# EAGLE design FilterSchematic_REV2 (EAGLE 8.2.2)
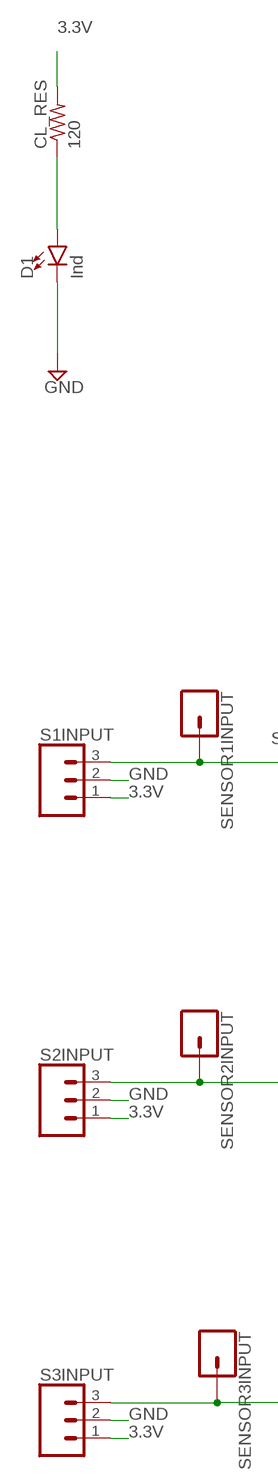
[diagram p0: schematic, sheet 1, part 1 of 2]
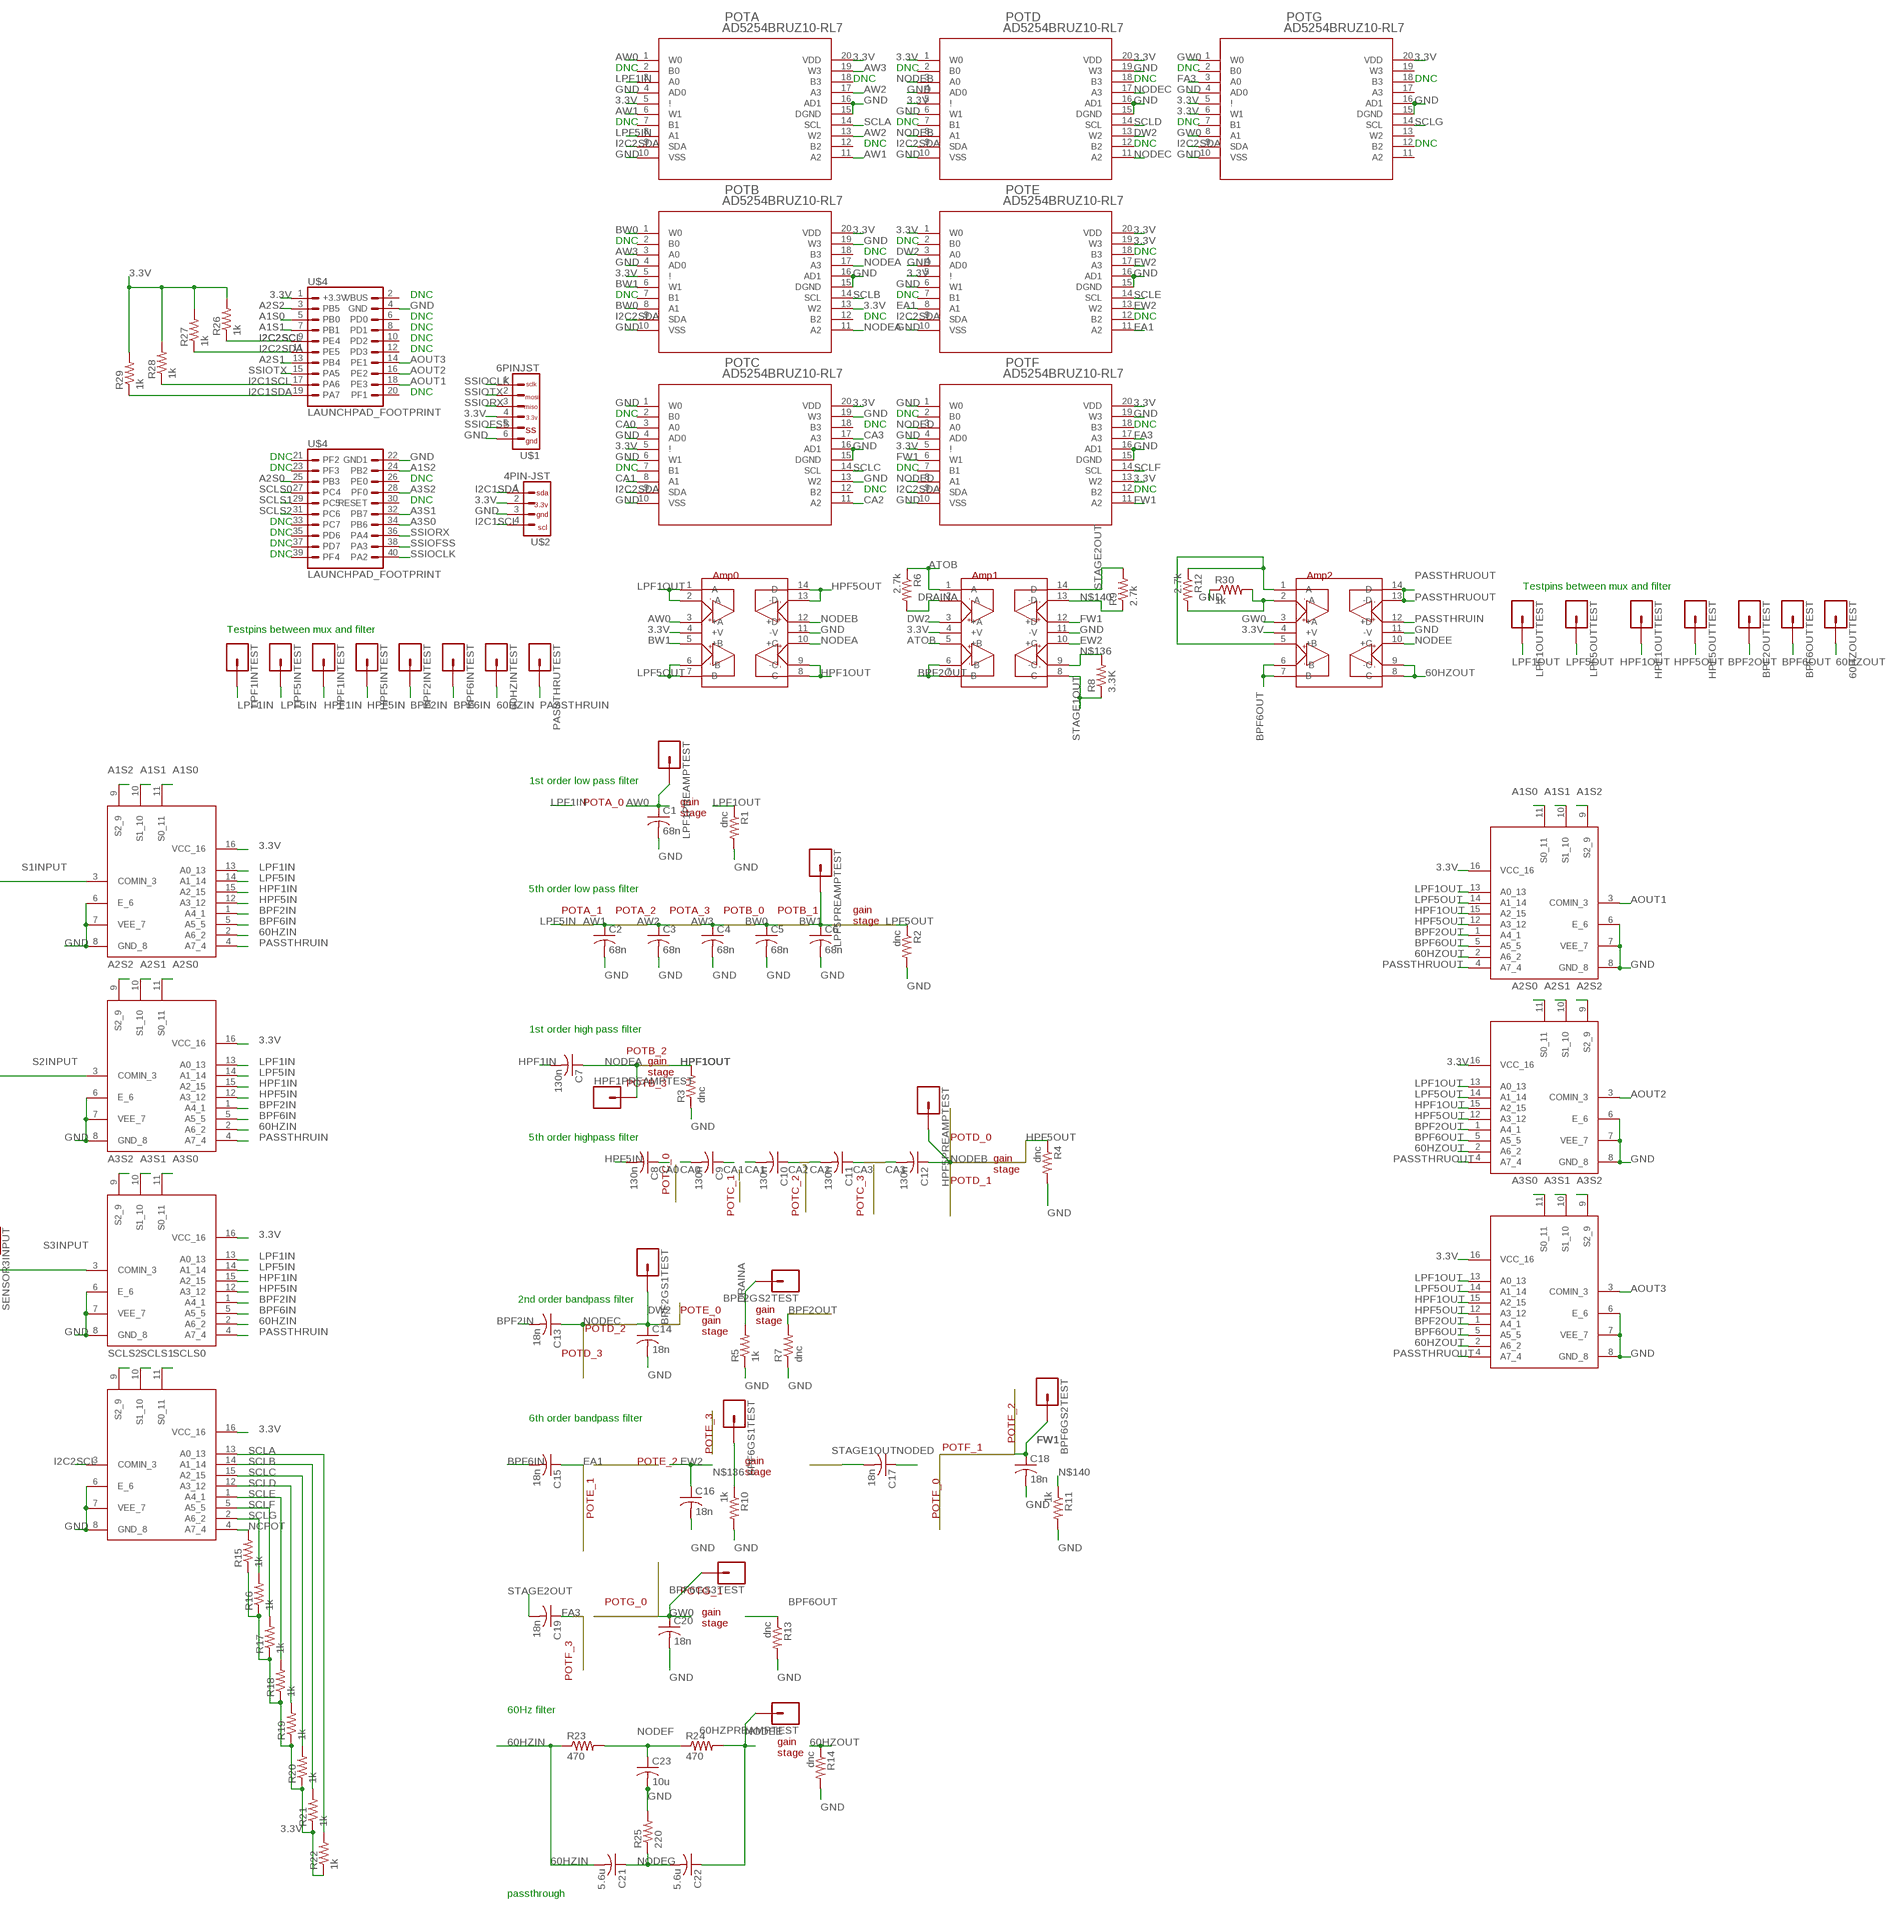
[diagram p1: schematic, sheet 1, part 2 of 2]

## Parts
60HZINTEST  CONN_01  [1X01]
60HZOUTTEST  CONN_01  [1X01]
60HZPREAMPTEST  CONN_01  [1X01]
A3IDEMUX  CD74HC4051-Q1  [TSSOP16]
AI1DEMUX  CD74HC4051-Q1  [TSSOP16]
AI2DEMUX  CD74HC4051-Q1  [TSSOP16]
AMP0  OPA4830  [TSSOP14]
AMP1  OPA4830  [TSSOP14]
AMP2  OPA4830  [TSSOP14]
AO1MUX  CD74HC4051-Q1  [TSSOP16]
AO2MUX  CD74HC4051-Q1  [TSSOP16]
AO3MUX  CD74HC4051-Q1  [TSSOP16]
BPF2GS1TEST  CONN_01  [1X01]
BPF2GS2TEST  CONN_01  [1X01]
BPF2INTEST  CONN_01  [1X01]
BPF2OUTTEST  CONN_01  [1X01]
BPF6GS1TEST  CONN_01  [1X01]
BPF6GS2TEST  CONN_01  [1X01]
BPF6GS3TEST  CONN_01  [1X01]
BPF6INTEST  CONN_01  [1X01]
BPF6OUTTEST  CONN_01  [1X01]
C1  68n  C-USC0805  [C0805]
C2  68n  C-USC0805  [C0805]
C3  68n  C-USC0805  [C0805]
C4  68n  C-USC0805  [C0805]
C5  68n  C-USC0805  [C0805]
C6  68n  C-USC0805  [C0805]
C7  130n  C-USC0805  [C0805]
C8  130n  C-USC0805  [C0805]
C9  130n  C-USC0805  [C0805]
C10  130n  C-USC0805  [C0805]
C11  130n  C-USC0805  [C0805]
C12  130n  C-USC0805  [C0805]
C13  18n  C-USC0805  [C0805]
C14  18n  C-USC0805  [C0805]
C15  18n  C-USC0805  [C0805]
C16  18n  C-USC0805  [C0805]
C17  18n  C-USC0805  [C0805]
C18  18n  C-USC0805  [C0805]
C19  18n  C-USC0805  [C0805]
C20  18n  C-USC0805  [C0805]
C21  5.6u  C-USC0805  [C0805]
C22  5.6u  C-USC0805  [C0805]
C23  10u  C-USC0805  [C0805]
CL_RES  120  R-US_R0805  [R0805]
D1  Ind  LED-GREEN0603  [LED-0603]
HPF1INTEST  CONN_01  [1X01]
HPF1OUTTEST  CONN_01  [1X01]
HPF1PREAMPTEST  CONN_01  [1X01]
HPF5INTEST  CONN_01  [1X01]
HPF5OUTTEST  CONN_01  [1X01]
HPF5PREAMPTEST  CONN_01  [1X01]
LPF1INTEST  CONN_01  [1X01]
LPF1OUTTEST  CONN_01  [1X01]
LPF1PREAMPTEST  CONN_01  [1X01]
LPF5INTEST  CONN_01  [1X01]
LPF5OUTTEST  CONN_01  [1X01]
LPF5PREAMPTEST  CONN_01  [1X01]
PASSTHRUTEST  CONN_01  [1X01]
POTA  AD5254BRUZ10-RL7  [RU_20]
POTB  AD5254BRUZ10-RL7  [RU_20]
POTC  AD5254BRUZ10-RL7  [RU_20]
POTD  AD5254BRUZ10-RL7  [RU_20]
POTE  AD5254BRUZ10-RL7  [RU_20]
POTF  AD5254BRUZ10-RL7  [RU_20]
POTG  AD5254BRUZ10-RL7  [RU_20]
R1  dnc  R-US_R0805  [R0805]
R2  dnc  R-US_R0805  [R0805]
R3  dnc  R-US_R0805  [R0805]
R4  dnc  R-US_R0805  [R0805]
R5  1k  R-US_R0805  [R0805]
R6  2.7k  R-US_R0805  [R0805]
R7  dnc  R-US_R0805  [R0805]
R8  3.3K  R-US_R0805  [R0805]
R9  2.7k  R-US_R0805  [R0805]
R10  1k  R-US_R0805  [R0805]
R11  1k  R-US_R0805  [R0805]
R12  2.7k  R-US_R0805  [R0805]
R13  dnc  R-US_R0805  [R0805]
R14  dnc  R-US_R0805  [R0805]
R15  1k  R-US_R0805  [R0805]
R16  1k  R-US_R0805  [R0805]
R17  1k  R-US_R0805  [R0805]
R18  1k  R-US_R0805  [R0805]
R19  1k  R-US_R0805  [R0805]
R20  1k  R-US_R0805  [R0805]
R21  1k  R-US_R0805  [R0805]
R22  1k  R-US_R0805  [R0805]
R23  470  R-US_R0805  [R0805]
R24  470  R-US_R0805  [R0805]
R25  220  R-US_R0805  [R0805]
R26  1k  R-US_R0805  [R0805]
R27  1k  R-US_R0805  [R0805]
R28  1k  R-US_R0805  [R0805]
R29  1k  R-US_R0805  [R0805]
R30  1k  R-US_R0805  [R0805]
S1INPUT  CONN_03JST-PTH-VERT  [JST-3-PTH-VERT]
S2INPUT  CONN_03JST-PTH-VERT  [JST-3-PTH-VERT]
S3INPUT  CONN_03JST-PTH-VERT  [JST-3-PTH-VERT]
SCLMUX  CD74HC4051-Q1  [TSSOP16]
SENSOR1INPUT  CONN_01  [1X01]
SENSOR2INPUT  CONN_01  [1X01]
SENSOR3INPUT  CONN_01  [1X01]
U$1  6PINJST  [JST-6-PTH-VERT]
U$2  4PIN-JST  [JST-4-PTH-VERT]
U$4  LAUNCHPAD_FOOTPRINT  [SSW-110-02-S-D]

## Nets
3.3V: A3IDEMUX.16(VCC_16) AI1DEMUX.16(VCC_16) AI2DEMUX.16(VCC_16) AMP0.4(+V) AMP1.4(+V) AMP2.4(+V) AO1MUX.16(VCC_16) AO2MUX.16(VCC_16) AO3MUX.16(VCC_16) CL_RES.2 POTA.5(!) POTA.20(VDD) POTB.5(!) POTB.13(W2) POTB.20(VDD) POTC.5(!) POTC.20(VDD) POTD.1(W0) POTD.5(!) POTD.20(VDD) POTE.1(W0) POTE.5(!) POTE.19(W3) POTE.20(VDD) POTF.5(!) POTF.13(W2) POTF.20(VDD) POTG.5(!) POTG.6(W1) POTG.20(VDD) R15.1 R16.1 R17.1 R18.1 R19.1 R20.1 R21.1 R22.1 R26.2 R27.2 R28.2 R29.2 S1INPUT.1 S2INPUT.1 S3INPUT.1 SCLMUX.16(VCC_16) U$1.4 U$2.2 U$4.1(+3.3V)
60HZIN: 60HZINTEST.1 A3IDEMUX.2(A6_2) AI1DEMUX.2(A6_2) AI2DEMUX.2(A6_2) C21.2 R23.1
60HZOUT: 60HZOUTTEST.1 AMP2.8(C) AMP2.9(-C) AO1MUX.2(A6_2) AO2MUX.2(A6_2) AO3MUX.2(A6_2) R14.1
A1S0: AI1DEMUX.11(S0_11) AO1MUX.11(S0_11) U$4.5(PB0)
A1S1: AI1DEMUX.10(S1_10) AO1MUX.10(S1_10) U$4.7(PB1)
A1S2: AI1DEMUX.9(S2_9) AO1MUX.9(S2_9) U$4.24(PB2)
A2S0: AI2DEMUX.11(S0_11) AO2MUX.11(S0_11) U$4.25(PB3)
A2S1: AI2DEMUX.10(S1_10) AO2MUX.10(S1_10) U$4.13(PB4)
A2S2: AI2DEMUX.9(S2_9) AO2MUX.9(S2_9) U$4.3(PB5)
A3S0: A3IDEMUX.11(S0_11) AO3MUX.11(S0_11) U$4.34(PB6)
A3S1: A3IDEMUX.10(S1_10) AO3MUX.10(S1_10) U$4.32(PB7)
A3S2: A3IDEMUX.9(S2_9) AO3MUX.9(S2_9) U$4.28(PF0)
AOUT1: AO1MUX.3(COMIN_3) U$4.18(PE3)
AOUT2: AO2MUX.3(COMIN_3) U$4.16(PE2)
AOUT3: AO3MUX.3(COMIN_3) U$4.14(PE1)
ATOB: AMP1.1(A) AMP1.5(+B) R6.1
AW0: AMP0.3(+A) C1.1 LPF1PREAMPTEST.1 POTA.1(W0)
AW1: C2.1 POTA.6(W1) POTA.11(A2)
AW2: C3.1 POTA.13(W2) POTA.17(A3)
AW3: C4.1 POTA.19(W3) POTB.3(A0)
BPF2IN: A3IDEMUX.1(A4_1) AI1DEMUX.1(A4_1) AI2DEMUX.1(A4_1) BPF2INTEST.1 C13.2
BPF2OUT: AMP1.6(-B) AMP1.7(B) AO1MUX.1(A4_1) AO2MUX.1(A4_1) AO3MUX.1(A4_1) BPF2OUTTEST.1 R7.2
BPF6IN: A3IDEMUX.5(A5_5) AI1DEMUX.5(A5_5) AI2DEMUX.5(A5_5) BPF6INTEST.1 C15.2
BPF6OUT: AMP2.6(-B) AMP2.7(B) AO1MUX.5(A5_5) AO2MUX.5(A5_5) AO3MUX.5(A5_5) BPF6OUTTEST.1 R13.1
BW0: C5.1 POTB.1(W0) POTB.8(A1)
BW1: AMP0.5(+B) C6.1 LPF5PREAMPTEST.1 POTB.6(W1)
CA0: C8.1 C9.2 POTC.3(A0)
CA1: C9.1 C10.2 POTC.8(A1)
CA2: C10.1 C11.2 POTC.11(A2)
CA3: C11.1 C12.2 POTC.17(A3)
DRAINA: AMP1.2(-A) BPF2GS2TEST.1 R5.2 R6.2
DW2: AMP1.3(+A) BPF2GS1TEST.1 C14.1 POTD.13(W2) POTE.3(A0)
EA1: C15.1 POTE.8(A1) POTE.11(A2)
EW2: AMP1.10(+C) C16.1 POTE.13(W2) POTE.17(A3)
FA3: C19.1 POTF.17(A3) POTG.3(A0)
FW1: AMP1.12(+D) BPF6GS2TEST.1 C18.1 POTF.6(W1) POTF.11(A2)
GND: A3IDEMUX.6(E_6) A3IDEMUX.7(VEE_7) A3IDEMUX.8(GND_8) AI1DEMUX.6(E_6) AI1DEMUX.7(VEE_7) AI1DEMUX.8(GND_8) AI2DEMUX.6(E_6) AI2DEMUX.7(VEE_7) AI2DEMUX.8(GND_8) AMP0.11(-V) AMP1.11(-V) AMP2.11(-V) AO1MUX.6(E_6) AO1MUX.7(VEE_7) AO1MUX.8(GND_8) AO2MUX.6(E_6) AO2MUX.7(VEE_7) AO2MUX.8(GND_8) AO3MUX.6(E_6) AO3MUX.7(VEE_7) AO3MUX.8(GND_8) C1.2 C2.2 C3.2 C4.2 C5.2 C6.2 C14.2 C16.2 C18.2 C20.2 C23.2 D1.C POTA.4(AD0) POTA.10(VSS) POTA.15(DGND) POTA.16(AD1) POTB.4(AD0) POTB.10(VSS) POTB.15(DGND) POTB.16(AD1) POTB.19(W3) POTC.1(W0) POTC.4(AD0) POTC.6(W1) POTC.10(VSS) POTC.13(W2) POTC.15(DGND) POTC.16(AD1) POTC.19(W3) POTD.4(AD0) POTD.6(W1) POTD.10(VSS) POTD.15(DGND) POTD.16(AD1) POTD.19(W3) POTE.4(AD0) POTE.6(W1) POTE.10(VSS) POTE.15(DGND) POTE.16(AD1) POTF.1(W0) POTF.4(AD0) POTF.10(VSS) POTF.15(DGND) POTF.16(AD1) POTF.19(W3) POTG.4(AD0) POTG.10(VSS) POTG.15(DGND) POTG.16(AD1) R1.2 R2.2 R3.1 R4.2 R5.1 R7.1 R10.2 R11.2 R13.2 R14.2 R25.2 R30.1 S1INPUT.2 S2INPUT.2 S3INPUT.2 SCLMUX.6(E_6) SCLMUX.7(VEE_7) SCLMUX.8(GND_8) U$1.6 U$2.3 U$4.4(GND) U$4.22(GND1)
GW0: AMP2.3(+A) BPF6GS3TEST.1 C20.1 POTG.1(W0) POTG.8(A1)
HPF1IN: A3IDEMUX.15(A2_15) AI1DEMUX.15(A2_15) AI2DEMUX.15(A2_15) C7.2 HPF1INTEST.1
HPF1OUT: AMP0.8(C) AMP0.9(-C) AO1MUX.15(A2_15) AO2MUX.15(A2_15) AO3MUX.15(A2_15) HPF1OUTTEST.1 R3.2
HPF5IN: A3IDEMUX.12(A3_12) AI1DEMUX.12(A3_12) AI2DEMUX.12(A3_12) C8.2 HPF5INTEST.1
HPF5OUT: AMP0.13(-D) AMP0.14(D) AO1MUX.12(A3_12) AO2MUX.12(A3_12) AO3MUX.12(A3_12) HPF5OUTTEST.1 R4.1
I2C1SCL: R28.1 U$2.4 U$4.17(PA6)
I2C1SDA: R29.1 U$2.1 U$4.19(PA7)
I2C2SCL: R26.1 SCLMUX.3(COMIN_3) U$4.9(PE4)
I2C2SDA: POTA.9(SDA) POTB.9(SDA) POTC.9(SDA) POTD.9(SDA) POTE.9(SDA) POTF.9(SDA) POTG.9(SDA) R27.1 U$4.11(PE5)
LPF1IN: A3IDEMUX.13(A0_13) AI1DEMUX.13(A0_13) AI2DEMUX.13(A0_13) LPF1INTEST.1 POTA.3(A0)
LPF1OUT: AMP0.1(A) AMP0.2(-A) AO1MUX.13(A0_13) AO2MUX.13(A0_13) AO3MUX.13(A0_13) LPF1OUTTEST.1 R1.1
LPF5IN: A3IDEMUX.14(A1_14) AI1DEMUX.14(A1_14) AI2DEMUX.14(A1_14) LPF5INTEST.1 POTA.8(A1)
LPF5OUT: AMP0.6(-B) AMP0.7(B) AO1MUX.14(A1_14) AO2MUX.14(A1_14) AO3MUX.14(A1_14) LPF5OUTTEST.1 R2.1
N$1: CL_RES.1 D1.A
N$136: AMP1.9(-C) BPF6GS1TEST.1 R8.2 R10.1
N$140: AMP1.13(-D) R9.1 R11.1
N$142: AMP2.1(A) AMP2.5(+B) R12.1
N$143: AMP2.2(-A) R12.2 R30.2
NCPOT: R15.2 SCLMUX.4(A7_4)
NODEA: AMP0.10(+C) C7.1 HPF1PREAMPTEST.1 POTB.11(A2) POTB.17(A3)
NODEB: AMP0.12(+D) C12.1 HPF5PREAMPTEST.1 POTD.3(A0) POTD.8(A1)
NODEC: C13.1 POTD.11(A2) POTD.17(A3)
NODED: C17.1 POTF.3(A0) POTF.8(A1)
NODEE: 60HZPREAMPTEST.1 AMP2.10(+C) C22.1 R24.2
NODEF: C23.1 R23.2 R24.1
NODEG: C21.1 C22.2 R25.1
PASSTHRUIN: A3IDEMUX.4(A7_4) AI1DEMUX.4(A7_4) AI2DEMUX.4(A7_4) AMP2.12(+D) PASSTHRUTEST.1
PASSTHRUOUT: AMP2.13(-D) AMP2.14(D) AO1MUX.4(A7_4) AO2MUX.4(A7_4) AO3MUX.4(A7_4)
S1INPUT: AI1DEMUX.3(COMIN_3) S1INPUT.3 SENSOR1INPUT.1
S2INPUT: AI2DEMUX.3(COMIN_3) S2INPUT.3 SENSOR2INPUT.1
S3INPUT: A3IDEMUX.3(COMIN_3) S3INPUT.3 SENSOR3INPUT.1
SCLA: POTA.14(SCL) R22.2 SCLMUX.13(A0_13)
SCLB: POTB.14(SCL) R21.2 SCLMUX.14(A1_14)
SCLC: POTC.14(SCL) R20.2 SCLMUX.15(A2_15)
SCLD: POTD.14(SCL) R19.2 SCLMUX.12(A3_12)
SCLE: POTE.14(SCL) R18.2 SCLMUX.1(A4_1)
SCLF: POTF.14(SCL) R17.2 SCLMUX.5(A5_5)
SCLG: POTG.14(SCL) R16.2 SCLMUX.2(A6_2)
SCLS0: SCLMUX.11(S0_11) U$4.27(PC4)
SCLS1: SCLMUX.10(S1_10) U$4.29(PC5)
SCLS2: SCLMUX.9(S2_9) U$4.31(PC6)
SSIOCLK: U$1.1 U$4.40(PA2)
SSIOFSS: U$1.5 U$4.38(PA3)
SSIORX: U$1.3 U$4.36(PA4)
SSIOTX: U$1.2 U$4.15(PA5)
STAGE1OUT: AMP1.8(C) C17.2 R8.1
STAGE2OUT: AMP1.14(D) C19.2 R9.2
Unconnected: POTA.2(B0) POTA.7(B1) POTA.12(B2) POTA.18(B3) POTB.2(B0) POTB.7(B1) POTB.12(B2) POTB.18(B3) POTC.2(B0) POTC.7(B1) POTC.12(B2) POTC.18(B3) POTD.2(B0) POTD.7(B1) POTD.12(B2) POTD.18(B3) POTE.2(B0) POTE.7(B1) POTE.12(B2) POTE.18(B3) POTF.2(B0) POTF.7(B1) POTF.12(B2) POTF.18(B3) POTG.2(B0) POTG.7(B1) POTG.11(A2) POTG.12(B2) POTG.13(W2) POTG.17(A3) POTG.18(B3) POTG.19(W3) U$4.2(VBUS) U$4.6(PD0) U$4.8(PD1) U$4.10(PD2) U$4.12(PD3) U$4.20(PF1) U$4.21(PF2) U$4.23(PF3) U$4.26(PE0) U$4.30(RESET) U$4.33(PC7) U$4.35(PD6) U$4.37(PD7) U$4.39(PF4)

## Notes on the sheet
- DNC | DNC | DNC
- DNC | DNC | DNC
- DNC | DNC | DNC
- DNC | DNC | DNC
- DNC | DNC
- DNC | DNC
- DNC | DNC | DNC
- DNC | DNC | DNC
- DNC
- DNC
- DNC
- DNC
- DNC | DNC
- DNC | DNC
- DNC
- DNC | DNC | DNC
- DNC
- DNC | DNC
- DNC
- DNC
- DNC
- DNC
- DNC
- Amp0 | Amp1 | Amp2
- Testpins between mux and filter
- Testpins between mux and filter
- 1st order low pass filter
- POTA_0
- gain
  stage
- 5th order low pass filter
- POTA_1 | POTA_2 | POTA_3 | POTB_0 | POTB_1
- gain
  stage
- 1st order high pass filter
- POTB_2
- gain
  stage
- POTB_3
- 5th order highpass filter | POTD_0
- gain
  stage
- POTD_1
- POTC_0
- POTC_1 | POTC_2 | POTC_3
- 2nd order bandpass filter
- POTE_0
- POTD_2
- gain
  stage
- gain
  stage
- POTD_3
- 6th order bandpass filter
- POTF_1 | POTF_2
- POTE_3
- POTE_2
- gain
  stage
- POTE_1 | POTF_0
- POTG_1
- POTG_0
- gain
  stage
- POTF_3
- 60Hz filter
- gain
  stage
- passthrough

## Library data of the parts
60HZINTEST 60HZOUTTEST 60HZPREAMPTEST BPF2GS1TEST BPF2GS2TEST BPF2INTEST BPF2OUTTEST BPF6GS1TEST BPF6GS2TEST BPF6GS3TEST BPF6INTEST BPF6OUTTEST HPF1INTEST HPF1OUTTEST HPF1PREAMPTEST HPF5INTEST HPF5OUTTEST HPF5PREAMPTEST LPF1INTEST LPF1OUTTEST LPF1PREAMPTEST LPF5INTEST LPF5OUTTEST LPF5PREAMPTEST PASSTHRUTEST SENSOR1INPUT SENSOR2INPUT SENSOR3INPUT = SparkFun-Connectors:CONN_01: Single connection point. Often used as Generic Header-pin footprint for 0.1 inch spaced/style header connections On any of the 0.1 inch spaced packages, you can populate with these: Break Away Headers - Straight <https://www.sparkfun.com/products/116> (PRT-00116) Break Away Male Headers - Right Angle <https://www.sparkfun.com/products/553> (PRT-00553) Female Headers <https://www.sparkfun.com/products/115> (PRT-00115) Break Away Headers - Machine Pin <https://www.sparkfun.com/products/117> (PRT-00117) Break Away Female Headers - Swiss Machine Pin <https://www.sparkfun.com/products/743> (PRT-00743) This device is also useful as a general connection point to wire up your design to another part of your project. Our various solder wires solder well into these plated through hole pads. Hook-Up Wire - Assortment (Stranded, 22 AWG) <https://www.sparkfun.com/products/11375> (PRT-11375) Hook-Up Wire - Assortment (Solid Core, 22 AWG) <https://www.sparkfun.com/products/11367> (PRT-11367) View the entire wire category on our website here <https://www.sparkfun.com/categories/141> Special notes: SMTSO-256-ET is a "flush mount" nut for a 4-40 screw. We mostly use this on specialty testbeds; it is a nice way to connect hardware to your PCB at an adjustable hieght. Also note, the SNAP packages are for using a snappable style connector. We sell a baggie of snaps and they are also used on two LilyPad designs: Snap Assortment - 30 pack (male and female) <https://www.sparkfun.com/products/11347> (DEV-11347) LilyPad Arduino SimpleSnap <https://www.sparkfun.com/products/10941> (DEV-10941) LilyPad SimpleSnap Protoboard <https://www.sparkfun.com/products/10940> (DEV-10940)
A3IDEMUX AI1DEMUX AI2DEMUX AO1MUX AO2MUX AO3MUX SCLMUX = 491Library:CD74HC4051-Q1
AMP0 AMP1 AMP2 = 491Library:OPA4830
C1-C23 = rcl:C-US: CAPACITOR, American symbol
CL_RES R1-R30 = rcl:R-US_: RESISTOR, American symbol
D1 = SparkFun-LED:LED-GREEN: Green SMD LED Used in manufacturing of various products at SparkFun Packages: 0603 - SMD 0603 package [Product Link] <http://www.futureelectronics.com/en/technologies/semiconductors/optoelectronics/leds/Pages/9894312-LTST-C190GKT.aspx?CrossPart=HSMG-C190&IM=0> LilyPad 1206 - SMD1206 LilyPad package [Product Link] <http://www.futureelectronics.com/en/Technologies/Product.aspx?ProductID=IN150NGHARVATEKCORPORATION2049943&IM=0> 1206 - SMD1206 package [Product Link] <http://www.futureelectronics.com/en/technologies/semiconductors/optoelectronics/leds/Pages/8315665-LTST-C150KGKT.aspx?IM=0> 1206 Bottom Mount -SMD 1206 Bottom Mount [Product Link] <http://www.digikey.com/product-detail/en/lite-on-inc/LTST-C230KGKT/160-1456-1-ND/386854> SparkFun Products: Pro Mini 328 -5V <https://www.sparkfun.com/products/821> RedBoard <https://www.sparkfun.com/products/12757> MP3 Trigger <https://www.sparkfun.com/products/13720> Makey Makey <https://www.sparkfun.com/products/11076>; PROD_ID: DIO-00821; VALUE: GREEN
POTA POTB POTC POTD POTE POTF POTG = 491Library:AD5254BRUZ10-RL7; MANUFACTURER_PART_NUMBER: AD5254BRUZ10RL7; VENDOR: Analog Devices Inc
S1INPUT S2INPUT S3INPUT = SparkFun-Connectors:CONN_03: Multi connection point. Often used as Generic Header-pin footprint for 0.1 inch spaced/style header connections On any of the 0.1 inch spaced packages, you can populate with these: Break Away Headers - Straight <https://www.sparkfun.com/products/116> (PRT-00116) Break Away Male Headers - Right Angle <https://www.sparkfun.com/products/553> (PRT-00553) Female Headers <https://www.sparkfun.com/products/115> (PRT-00115) Break Away Headers - Machine Pin <https://www.sparkfun.com/products/117> (PRT-00117) Break Away Female Headers - Swiss Machine Pin <https://www.sparkfun.com/products/743> (PRT-00743) Stackable Header - 3 Pin (Female, 0.1") <https://www.sparkfun.com/products/13875> (PRT-13875) For SCREWTERMINALS and SPRING TERMINALS visit here: Screw Terimnals on SparkFun.com <https://www.sparkfun.com/search/results?term=Screw+Terminals> (5mm/3.5mm/2.54mm spacing) This device is also useful as a general connection point to wire up your design to another part of your project. Our various solder wires solder well into these plated through hole pads. Hook-Up Wire - Assortment (Stranded, 22 AWG) <https://www.sparkfun.com/products/11375> (PRT-11375) Hook-Up Wire - Assortment (Solid Core, 22 AWG) <https://www.sparkfun.com/products/11367> (PRT-11367) View the entire wire category on our website here <https://www.sparkfun.com/categories/141> Special notes: Molex polarized connector foot print use with SKU : PRT-08232 with associated crimp pins and housings.; PROD_ID: CONN-13230
U$1 = 491Library:6PINJST
U$2 = 491Library:4PIN-JST
U$4 = 491Library:LAUNCHPAD_FOOTPRINT

## Board
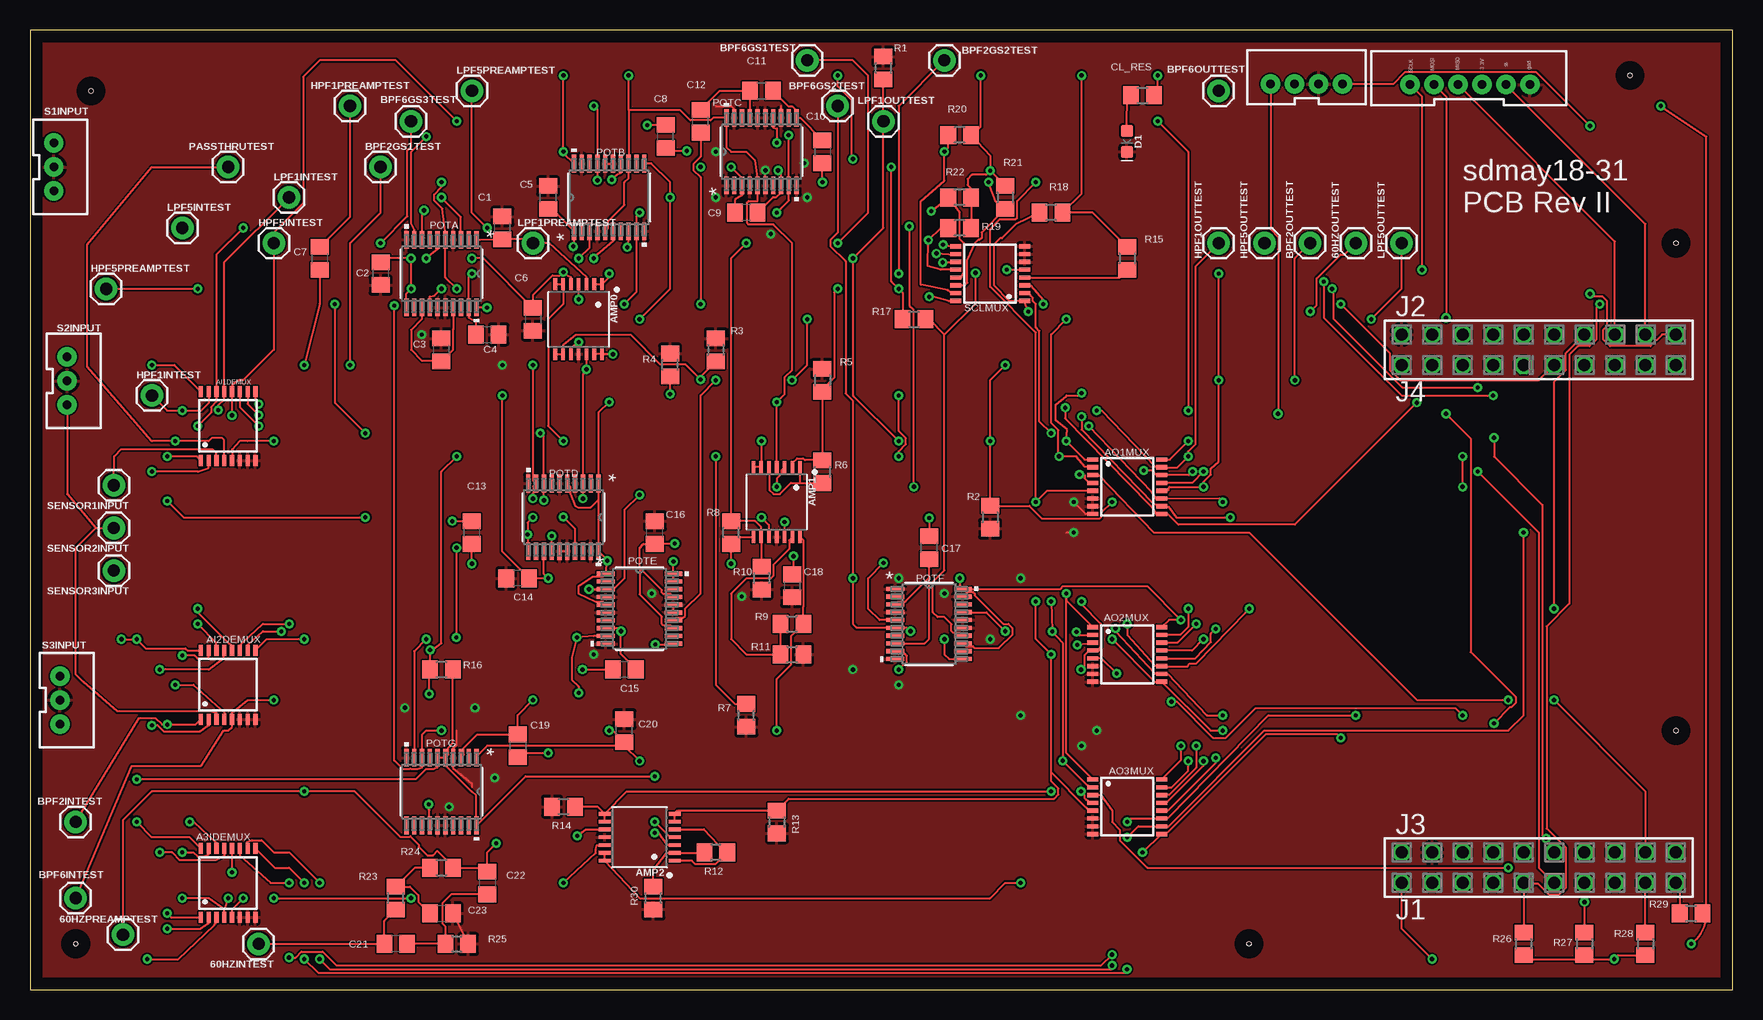
[diagram p2: board, top side]
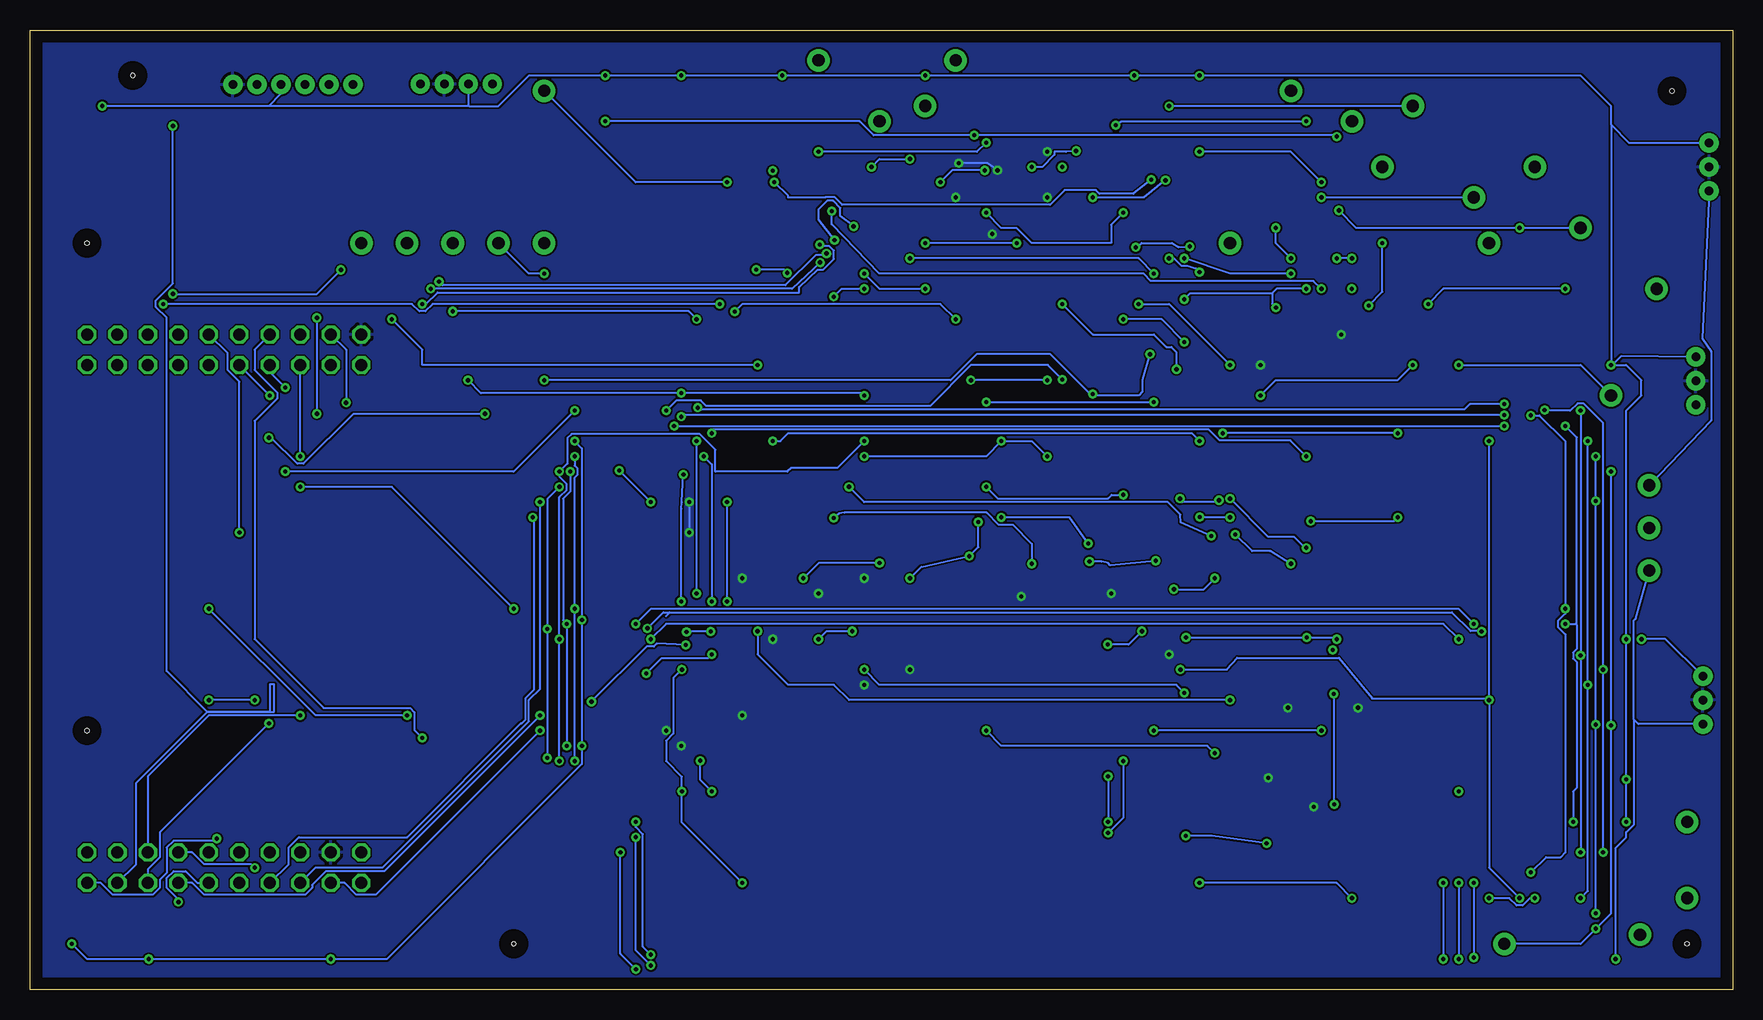
[diagram p3: board, bottom side, seen from below]

Size 141.91 x 80 mm. Coordinates in mm from the lower left corner, seen from the top.
Outline: 0,0 141.91,0 141.91,80 0,80 0,0
Copper layers (1*16): Top 0.035mm / dielectric 1.5mm / Bottom 0.035mm
Design rules "default": minimum track width 6mil, minimum drill 0.35mm, track to track 6mil, track to pad 6mil, pad to pad 6mil, via to via 6mil, smd to smd 6mil, copper to edge 40mil, drill to drill 6mil, minimum pad ring 10mil, minimum via ring 8mil, stop-mask expansion 4mil, vias tented up to drill 0mil, thermal gap 10mil
Holes 0.35 mm at 5.08,74.93 3.81,3.81 101.6,3.81 137.16,21.59 137.16,62.23 133.35,76.2

### Footprints (pad centres in the part's own frame; a part is rotated, then mirrored left to right if it is on the bottom)
1X01 = drill 1.016 pad 1.88: 1 0,0
TSSOP16 = smd 0.9 x 0.35: 1 -2.875,2.275; 2 -2.875,1.625; 3 -2.875,0.975; 4 -2.875,0.325; 5 -2.875,-0.325; 6 -2.875,-0.975; 7 -2.875,-1.625; 8 -2.875,-2.275; 9 2.875,-2.275; 10 2.875,-1.625; 11 2.875,-0.975; 12 2.875,-0.325; 13 2.875,0.325; 14 2.875,0.975; 15 2.875,1.625; 16 2.875,2.275
TSSOP14 = smd 0.305 x 0.991: 1 -1.95,-2.918; 2 -1.3,-2.918; 3 -0.65,-2.918; 4 0,-2.918; 5 0.65,-2.918; 6 1.3,-2.918; 7 1.95,-2.918; 8 1.95,2.918; 9 1.3,2.918; 10 0.65,2.918; 11 0,2.918; 12 -0.65,2.918; 13 -1.3,2.918; 14 -1.95,2.918
C0805 = smd 1.3 x 1.5: 1 -0.95,0; 2 0.95,0
R0805 = smd 1.3 x 1.5: 1 -0.95,0; 2 0.95,0
LED-0603 = smd 1 x 1: A -0.877,0; C 0.877,0
RU_20 = smd 1.473 x 0.356: 1 -2.819,2.925; 2 -2.819,2.275; 3 -2.819,1.625; 4 -2.819,0.975; 5 -2.819,0.325; 6 -2.819,-0.325; 7 -2.819,-0.975; 8 -2.819,-1.625; 9 -2.819,-2.275; 10 -2.819,-2.925; 11 2.819,-2.925; 12 2.819,-2.275; 13 2.819,-1.625; 14 2.819,-0.975; 15 2.819,-0.325; 16 2.819,0.325; 17 2.819,0.975; 18 2.819,1.625; 19 2.819,2.275; 20 2.819,2.925
JST-3-PTH-VERT = drill 0.7 pad 1.6: 1 -2,-0.55; 2 0,-0.55; 3 2,-0.55
JST-6-PTH-VERT = drill 0.7 pad 1.6: 1 -3,-0.55; 2 -1,-0.55; 3 1,-0.55; 4 3,-0.55; 5 4.999,-0.547; 6 6.999,-0.547
JST-4-PTH-VERT = drill 0.7 pad 1.6: 1 -3,-0.55; 2 -1,-0.55; 3 1,-0.55; 4 3,-0.55
SSW-110-02-S-D = drill 1 pad 1.5 octagon: 1 -22.86,11.43; 2 -20.32,11.43; 3 -22.86,8.89; 4 -20.32,8.89; 5 -22.86,6.35; 6 -20.32,6.35; 7 -22.86,3.81; 8 -20.32,3.81; 9 -22.86,1.27; 10 -20.32,1.27; 11 -22.86,-1.27; 12 -20.32,-1.27; 13 -22.86,-3.81; 14 -20.32,-3.81; 15 -22.86,-6.35; 16 -20.32,-6.35; 17 -22.86,-8.89; 18 -20.32,-8.89; 19 -22.86,-11.43; 20 -20.32,-11.43; 21 20.32,11.43; 22 22.86,11.43; 23 20.32,8.89; 24 22.86,8.89; 25 20.32,6.35; 26 22.86,6.35; 27 20.32,3.81; 28 22.86,3.81; 29 20.32,1.27; 30 22.86,1.27; 31 20.32,-1.27; 32 22.86,-1.27; 33 20.32,-3.81; 34 22.86,-3.81; 35 20.32,-6.35; 36 22.86,-6.35; 37 20.32,-8.89; 38 22.86,-8.89; 39 20.32,-11.43; 40 22.86,-11.43

### Placement (x,y rotation side)
60HZINTEST  19.05,3.81 180 top
60HZOUTTEST  110.49,62.23 90 top
60HZPREAMPTEST  7.75,4.57 90 top
A3IDEMUX  16.51,8.89 90 top
AI1DEMUX  16.51,46.99 90 top
AI2DEMUX  16.51,25.4 90 top
AMP0  45.72,55.88 180 top
AMP1  62.23,40.64 180 top
AMP2  50.8,12.7 90 top
AO1MUX  91.44,41.91 0 top
AO2MUX  91.44,27.94 0 top
AO3MUX  91.44,15.24 0 top
BPF2GS1TEST  29.21,68.58 0 top
BPF2GS2TEST  76.2,77.47 0 top
BPF2INTEST  3.81,13.97 90 top
BPF2OUTTEST  106.68,62.23 90 top
BPF6GS1TEST  64.77,77.47 0 top
BPF6GS2TEST  67.31,73.66 0 top
BPF6GS3TEST  31.75,72.39 0 top
BPF6INTEST  3.81,7.62 90 top
BPF6OUTTEST  99.06,74.93 90 top
C1  39.37,63.5 90 top
C2  29.21,59.69 270 top
C3  34.29,53.34 90 top
C4  38.1,54.61 0 top
C5  43.18,66.04 90 top
C6  41.91,55.88 270 top
C7  24.13,60.96 270 top
C8  52.96,71.12 90 top
C9  59.69,64.77 180 top
C10  66.04,69.85 270 top
C11  60.96,74.93 0 top
C12  55.88,72.39 90 top
C13  36.83,38.1 90 top
C14  40.64,34.29 180 top
C15  49.53,26.67 180 top
C16  52.07,38.1 90 top
C17  74.93,36.83 90 top
C18  63.5,33.66 270 top
C19  40.64,20.32 270 top
C20  49.53,21.59 90 top
C21  30.48,3.81 180 top
C22  38.1,8.89 270 top
C23  34.29,6.35 0 top
CL_RES  92.71,74.55 0 top
D1  91.41,70.71 270 top
HPF1INTEST  10.16,49.53 0 top
HPF1OUTTEST  99.06,62.23 90 top
HPF1PREAMPTEST  26.67,73.66 0 top
HPF5INTEST  20.32,62.23 0 top
HPF5OUTTEST  102.87,62.23 90 top
HPF5PREAMPTEST  6.35,58.42 0 top
LPF1INTEST  21.59,66.04 0 top
LPF1OUTTEST  71.12,72.39 0 top
LPF1PREAMPTEST  41.91,62.23 0 top
LPF5INTEST  12.7,63.5 0 top
LPF5OUTTEST  114.3,62.23 90 top
LPF5PREAMPTEST  36.83,74.93 0 top
PASSTHRUTEST  16.51,68.58 0 top
POTA  34.29,59.69 270 top
POTB  48.26,66.04 90 top
POTC  60.96,69.85 90 top
POTD  44.45,39.37 270 top
POTE  50.8,31.75 0 top
POTF  74.93,30.48 0 top
POTG  34.29,16.51 270 top
R1  71.12,76.83 90 top
R2  80.01,39.37 270 top
R3  57.15,53.34 270 top
R4  53.34,52.07 90 top
R5  66.04,50.8 270 top
R6  66.04,43.18 90 top
R7  59.69,22.86 90 top
R8  58.42,38.1 90 top
R9  63.5,30.48 0 top
R10  60.96,34.29 270 top
R11  63.5,27.94 0 top
R12  57.15,11.43 180 top
R13  62.23,13.97 270 top
R14  44.45,15.24 180 top
R15  91.44,60.96 270 top
R16  34.29,26.67 180 top
R17  73.66,55.88 0 top
R18  85.09,64.77 180 top
R19  77.47,63.5 180 top
R20  77.47,71.25 180 top
R21  81.28,66.04 270 top
R22  77.47,66.04 180 top
R23  30.48,7.62 90 top
R24  34.29,10.16 0 top
R25  35.56,3.81 0 top
R26  124.46,3.81 270 top
R27  129.54,3.81 270 top
R28  134.62,3.81 270 top
R29  138.43,6.35 0 top
R30  51.94,7.62 90 top
S1INPUT  2.54,68.58 270 top
S2INPUT  3.64,50.74 270 top
S3INPUT  3.05,24.13 270 top
SCLMUX  80.01,59.69 180 top
SENSOR1INPUT  6.99,42.04 180 top
SENSOR2INPUT  6.99,38.48 180 top
SENSOR3INPUT  6.99,34.92 180 top
U$1  118,76 0 top
U$2  106.38,76.05 0 top
U$4  125.73,31.75 90 top

### Tracks (layer width: path | path; a pad name or v marks a point on that pad's centre or on a via)
3.3V  (via drill 0.35)
  Top 0.152: A3IDEMUX.16 13.3,12.7 10.16,12.7 v8.89,13.97 | AI2DEMUX.16 13.13,28.27 12.95,28.46 9.64,28.46 8.91,29.19 | 8.91,29.19 v8.89,29.21 | v10.16,52.07 12.03,52.07 AI1DEMUX.16 | v135.89,73.66 139.7,71.12 139.7,6.35 | 139.7,6.35 arc-53 v138.43,3.81 | v116.84,2.54 114.3,5.08 U$4.1 | v8.89,17.52 32.16,17.52 33.02,18.39 33.04,18.36 33.59,18.36 33.96,18.51 33.96,19.09 POTG.6 POTG.5 | v52.07,17.78 41.3,17.78 POTG.20 37.17,13.73 37.17,16.17 36.83,16.51 36.78,16.51 34.62,18.68 POTG.5 | v52.07,13.97 53.34,12.7 AMP2.4 | POTB.20 44.45,69.74 v44.45,69.85 v44.45,76.2 | 49.88,73.31 v49.88,76.2 | 49.88,73.31 POTB.13 49.88,67.67 49.53,67.31 49.53,65.4 48.18,64.05 48.18,63.46 POTB.5 | AO1MUX.16 94.98,44.19 v96.52,45.72 | v95.91,20.32 95.91,19.11 AO3MUX.16 | AO2MUX.16 94.92,30.82 v95.91,30.82 93.11,33.63 86.11,33.63 85.89,33.41 POTF.20 | CL_RES.2 93.98,75.25 v93.98,76.2 | v79.22,76.2 79.22,71.92 R20.1 80.01,69.53 v80.01,68.26 | v87.63,76.2 87.63,66.36 R18.1 88.58,64.77 R15.1 | R19.1 R22.1 78.42,66.78 78.13,67.07 78.13,67.57 78.49,67.93 79.68,67.93 v80.01,68.26 | v38.08,56.85 POTA.20 | v45.72,57.54 AMP0.4 | v35.56,58.42 34.62,59.37 POTA.5 34.64,62.9 34.37,65.1 33.68,65.79 33.68,66.29 34.29,66.9 v34.29,67.31 | 124.47,2.85 R26.2 124.78,2.54 129.55,2.54 129.54,2.55 R27.2 129.86,2.54 v132.01,2.54 132.34,2.86 R28.2 134.56,2.79 | POTG.5 34.86,19.57 34.86,20.16 35.24,20.54 R16.1 | 49.88,73.31 54.18,73.31 55.03,72.46 56.73,72.46 56.93,72.67 POTC.20 58.03,70.23 58.42,69.85 59.69,69.85 60.39,69.15 60.64,67.38 POTC.5 60.63,65.75 59.9,65.75 59.76,65.61 59.76,63.92 59.9,63.79 61.94,63.79 63.5,62.23 63.5,51.66 62.89,51.05 62.89,49.63 v62.23,48.97 AMP1.4
  Top 0.152: POTD.1 | POTD.1 47.38,40.82 | 47.38,40.82 POTD.20 47.98,35.95 v48.11,35.75 POTE.1 47.74,34.43 46.9,34.43 45.72,33.64 45.72,32.98 47.15,32.32 47.74,32.32 POTE.5 | POTD.5 45.02,41.95 45.02,41.36 45.43,40.31 45.71,40.19 46.72,40.19 47.38,40.82 | v53.62,35.69 POTE.19 POTE.20 | v48.26,48.97 47.38,48.08 POTD.1 | POTF.20 77.99,33.16 78.58,33.16 78.72,33.03 78.72,32.87 79.82,31.76 81.1,30.48 81.53,30.48 81.89,30.12 81.89,29.62 80.74,28.48 78.72,28.48 78.58,28.61 77.99,28.61 POTF.13 | POTF.5 70.8,30.8 69.85,31.75 69.85,34.29 v71.12,35.56 | v77.47,34.29 77.47,33.68 POTF.20 | SCLMUX.16 76.89,57.38 76.59,57.38 75.22,57.76 v74.93,57.76 | R17.1 72.71,58.1 v72.39,58.42 71.78,59.03 v71.78,68.58 | v67.31,76.2 67.31,75.31 68.48,74.14 68.48,69.34 v68.58,69.24 | R21.1 v80.01,68.26 | R29.2 139.7,6.35 | v7.62,29.21 7.64,29.19 8.91,29.19
  Bottom 0.152: v8.89,13.97 v8.89,17.52 v8.89,29.21 8.89,48.26 7.62,49.53 7.62,50.8 8.89,52.07 10.04,52.07 | 10.04,52.07 v10.16,52.07 10.16,72.11 | 10.16,72.11 10.16,73.66 12.7,76.2 v44.45,76.2 v49.88,76.2 v67.31,76.2 v79.22,76.2 v87.63,76.2 v93.98,76.2 100.33,76.2 102.87,73.66 105.31,73.66 | v138.43,3.81 137.16,2.54 v132.01,2.54 v116.84,2.54 112.17,2.54 95.91,18.8 v95.91,20.32 v95.91,30.82 95.91,45.11 v96.52,45.72 | v52.07,17.78 v52.07,13.97 | v62.23,48.97 v48.26,48.97 | v71.12,35.56 76.2,35.56 v77.47,34.29 | v74.93,57.76 74.27,58.42 v72.39,58.42 | v71.78,68.58 71.12,69.24 v68.58,69.24 | v34.29,67.31 36.83,69.85 v44.45,69.85 | v48.11,35.75 51.88,35.37 52.07,35.56 52.6,35.69 v53.62,35.69 | 38.39,58.05 45.21,58.05 v45.72,57.54 | v35.56,58.42 38.02,58.42 38.39,58.05 | 38.39,58.05 38.39,57.16 v38.08,56.85 | 105.31,73.66 122.01,73.66 | 122.01,73.66 v135.89,73.66 | S3INPUT.1 5.62,29.21 v7.62,29.21 | S2INPUT.1 9.31,52.8 10.04,52.07 | S1INPUT.1 8.63,70.58 10.16,72.11 | U$1.4 121,74.67 122.01,73.66 | U$2.2 105.38,73.72 105.31,73.66
60HZIN  (via drill 0.35)
  Top 0.152: v10.16,43.18 14,43.18 14.88,43.5 AI1DEMUX.2 | A3IDEMUX.2 14.89,5.8 14.89,5.5 14.25,5.08 v11.43,5.08 | AI2DEMUX.2 14.87,22.35 14.91,22.02 14.14,21.48 11.18,21.48 10.63,22.03 v10.16,22.03 | 60HZINTEST.1 C21.2 29.53,5.72 R23.1
  Bottom 0.152: v10.16,43.18 v10.16,22.03 10.16,6.35 v11.43,5.08 12.7,3.81 60HZINTEST.1
60HZOUT  (via drill 0.35)
  Top 0.152: AO1MUX.2 88.4,43.57 87.95,43.57 87.2,44.45 v85.75,44.45 85.7,44.51 85.7,46.63 85.09,47.24 85.09,54.61 v86.36,55.88 | v85.09,32.36 v85.19,29.84 86.06,28.91 v86.06,19.08 88.02,17.11 88.51,16.84 AO3MUX.2 | AMP2.9 AMP2.8 | AMP2.8 49.74,16.51 v85.09,16.51 | AMP2.8 47.29,15.24 R14.1 | v106.68,56.54 107.22,57.08 107.22,59.28 109.22,61.28 109.54,61.28 60HZOUTTEST.1 | v87.2,29.82 87.33,29.57 AO2MUX.2
  Bottom 0.152: v85.75,44.45 85.09,43.79 v85.09,32.36 | v85.09,16.51 86.06,17.48 v86.06,19.08 | v86.36,55.88 87.02,56.54 v106.68,56.54 | v85.19,29.84 87.18,29.84 v87.2,29.82
A1S0  (via drill 0.35)
  Top 0.152: AI1DEMUX.11 17.48,48.55 v19.05,46.99 | v88.24,46.99 93.47,41.49 93.88,40.87 94.02,40.94 | AO1MUX.11 94.02,40.94 | 94.02,40.94 94.04,40.91 99.1,40.94 v99.41,40.64
  Bottom 0.152: v88.24,46.99 v19.05,46.99 | U$4.5 118.09,10.18 112.52,10.18 100.33,22.37 100.33,24.13 99.41,25.05 v99.41,40.64
A1S1  (via drill 0.35)
  Top 0.152: AI1DEMUX.10 18.14,48.81 v19.05,47.9 | v87.63,47.76 87.63,46.67 93.59,40.54 94.09,40.31 AO1MUX.10 94.56,40.27 94.86,40.27 95.53,39.37 v100.01,39.37
  Bottom 0.152: v19.05,47.9 87.49,47.9 v87.63,47.76 | v100.01,39.37 99.91,39.27 99.91,24.98 100.64,24.26 100.64,22.49 100.93,22.19 101,22.19 110.49,12.7 119.5,12.7 120.36,11.84 120.36,10.45 U$4.7
A1S2  (via drill 0.35)
  Top 0.152: AI1DEMUX.9 18.79,49.07 v19.05,48.81 | v86.26,48.51 86.26,47.61 93.3,40.4 93.64,40.02 93.85,39.65 94.15,39.65 AO1MUX.9 94.83,39.63 95.7,38.76 105.41,38.76 v115.57,48.92
  Bottom 0.152: v19.05,48.81 21.93,48.81 22.38,48.36 86.26,48.36 v86.26,48.51 | U$4.24 115.57,53.34 v115.57,48.92
A2S0  (via drill 0.35)
  Top 0.152: AI2DEMUX.11 17.49,28.7 17.73,28.94 19.4,30.49 v21.6,30.49 | v91.44,30.48 91.44,29.54 93.72,27.02 94.04,27 AO2MUX.11 94.54,26.96 96.5,26.96 96.62,27.19 97.18,27.19 101.34,31.47 101.34,31.49 v101.6,31.75 | v119.38,41.91 v119.38,44.45
  Bottom 0.152: v21.6,30.49 22.86,31.75 90.17,31.75 v91.44,30.48 | v101.6,31.75 111.76,41.91 v119.38,41.91 | v119.38,44.45 U$4.25
A2S1  (via drill 0.35)
  Top 0.152: AI2DEMUX.10 18.14,28.73 19.41,29.87 19.41,29.85 v20.95,29.85 | v99.41,22.86 98.07,22.86 94.82,26.31 94.52,26.31 AO2MUX.10 94.03,26.36 93.73,26.36 90.46,29.87 v90.46,30.12
  Bottom 0.152: v20.95,29.85 20.98,29.88 21.85,29.88 23.41,31.45 88.6,31.45 | 88.6,31.45 88.9,31.14 | v99.41,22.86 112.39,9.87 117.25,9.87 118.4,8.72 118.4,8.48 118.97,7.91 127.41,7.91 128.39,8.89 U$4.13 | v90.46,30.12 89.13,31.45 88.6,31.45
A2S2  (via drill 0.35)
  Top 0.152: AI2DEMUX.9 19.72,29.21 v22.86,29.21 | v90.17,29.21 93.72,25.66 AO2MUX.9 98.39,21.59 v99.41,21.59
  Bottom 0.152: v22.86,29.21 24.13,30.48 88.9,30.48 v90.17,29.21 | U$4.3 115.69,8.89 114.71,7.91 113.09,7.91 v99.41,21.59
A3S0  (via drill 0.35)
  Top 0.152: A3IDEMUX.11 17.47,11.5 17.48,11.2 20.06,8.89 v21.59,8.89 | v21.59,2.66 22.13,2.66 22.61,3.15 24.38,3.15 25.52,2.01 89.26,2.01 v90.17,2.91 | v91.44,13.97 91.73,14.27 AO3MUX.11 94.55,14.31 94.85,14.31 103.21,22.86 v110.49,22.86 | v127,31.75 127,50.68 127.98,51.66 127.98,53.05 U$4.34
  Bottom 0.152: v21.59,8.89 v21.59,2.66 21.59,2.54 | v91.44,13.97 91.44,13.56 90.83,12.95 90.83,3.58 v90.17,2.91 | v110.49,22.86 118.11,22.86 v127,31.75
A3S1  (via drill 0.35)
  Top 0.152: A3IDEMUX.10 18.12,12.31 18.32,12.41 18.52,12.44 19.31,12.44 20.32,11.43 21.59,11.43 v24.13,8.89 | v24.13,2.54 24.97,1.7 90.17,1.7 v90.17,2 | v91.44,12.7 92.36,13.62 AO3MUX.10 94.89,13.62 102.87,21.59 123.19,21.59 124.46,22.86 v124.46,38.1
  Bottom 0.152: v24.13,8.89 v24.13,2.54 | v90.17,2 91.44,3.27 v91.44,12.7 | v124.46,38.1 124.46,50.68 125.44,51.66 125.44,53.05 U$4.32
A3S2  (via drill 0.35)
  Top 0.152: A3IDEMUX.9 20.39,10.16 21.59,10.16 v22.86,8.89 | v22.86,2.54 24,1.4 91.44,1.4 91.42,1.42 v91.42,1.7 | v92.71,11.43 AO3MUX.9 94.54,12.89 94.92,13.21 103,21.29 108.92,21.29 v109.22,20.98
  Bottom 0.152: v22.86,8.89 v22.86,2.54 | v91.42,1.7 92.71,2.99 v92.71,11.43 | U$4.28 123.19,53.34 123.19,51.66 121.31,49.78 121.31,49.28 123.19,47.4 123.19,29.21 117.45,23.47 110.24,23.47 109.88,23.11 109.88,21.65 v109.22,20.98
AOUT1  (via drill 0.35)
  Top 0.152: AO1MUX.3 88.8,42.88 89.09,42.88 93.65,38.1 101.6,38.1 115.57,24.13 v123.19,24.13 | v127,24.13 134.62,16.51 U$4.18
  Bottom 0.152: v123.19,24.13 v127,24.13
AOUT2  (via drill 0.35)
  Top 0.152: AO2MUX.3 88.56,28.85 v87.27,28.72 | v95.12,24 95.55,24 98.57,20.98 99.66,20.98 102.14,23.47 118.77,23.47 v119.38,22.86
  Bottom 0.152: v87.27,28.72 89.67,28.85 89.92,28.6 90.52,28.6 v95.12,24 | v119.38,22.86 127,22.86 132.08,17.78 U$4.16
AOUT3  (via drill 0.35)
  Top 0.152: AO3MUX.3 88.82,16.23 89.23,16.22 90.17,14.91 90.17,13.97 90.83,13.31 90.83,12.45 93.12,10.16 v123.19,10.16
  Bottom 0.152: v123.19,10.16 123.48,10.45 127.41,10.45 128.39,11.43 U$4.14
ATOB
  Top 0.152: 64.18,42.23 AMP1.1 | 64.18,42.23 R6.1 | AMP1.5 61.62,43.52 61.62,41.66 61.98,41.3 62.48,41.3 63.41,42.23 64.18,42.23
AW0
  Top 0.152: POTA.1 37.5,62.51 C1.1 41.59,62.55 LPF1PREAMPTEST.1 43.26,62.23 46.38,59.39 46.38,59.07 AMP0.3
AW1  (via drill 0.35)
  Top 0.152: C2.1 29.53,60.96 v31.75,60.96 31.76,60.95 v31.76,58.42 31.36,58.02 POTA.11 | POTA.6 33.97,62.3 33.97,61.72 33.02,60.98 v33.02,60.96
  Bottom 0.152: v31.75,60.96 v33.02,60.96
AW2
  Top 0.152: POTA.17 35.27,55.04 35.27,55.03 35.27,53.37 34.33,52.43 | POTA.13 32.66,55.91 31.75,55 31.75,53.34 32.66,52.43 34.33,52.43 | 34.33,52.43 C3.1 33.97,52.39
AW3  (via drill 0.35)
  Top 0.152: C4.1 37.15,55.7 36.55,56.02 36.55,56.61 POTA.19 36.56,59.42 v36.83,59.69 | v45.72,60.96 46.63,61.88 POTB.3
  Bottom 0.152: v36.83,59.69 41.91,59.69 v45.72,60.96
BPF2IN  (via drill 0.35)
  Top 0.152: AI1DEMUX.1 13.9,44.45 v11.43,44.45 | v11.43,6.35 11.77,6.01 A3IDEMUX.1 | AI2DEMUX.1 13.8,22.09 v11.43,22.09 11,22.09 10.46,22.64 9.11,22.64 BPF2INTEST.1 | v11.43,40.74 12.8,39.37 v27.94,39.37 | v35.18,39.05 C13.2
  Bottom 0.152: v11.43,44.45 v11.43,40.74 v11.43,22.09 v11.43,6.35 | v27.94,39.37 28.26,39.05 v35.18,39.05
BPF2OUT  (via drill 0.35)
  Top 0.152: AO2MUX.1 86.36,32.42 v86.36,33.02 86.36,19.72 AO3MUX.1 | AO1MUX.1 87.89,44.19 v86.36,45.72 86.42,46.68 85.49,47.42 85.49,48.76 86.36,49.47 86.36,49.53 87.44,49.53 v87.63,49.72 | v105.41,50.8 105.41,60.96 BPF2OUTTEST.1 | AMP1.7 AMP1.6 60.96,43.59 v60.96,45.72 | v72.39,44.45 72.39,44.86 73,45.47 73,45.97 72.39,46.58 v72.39,49.53 | v57.15,44.45 57.15,25.4 58.74,23.81 R7.2
  Bottom 0.152: v86.36,33.02 v86.36,45.72 | v105.41,50.8 104.33,49.72 v87.63,49.72 72.58,49.72 v72.39,49.53 | v72.39,44.45 62.23,44.45 v60.96,45.72 58.42,45.72 v57.15,44.45
BPF6IN  (via drill 0.35)
  Top 0.152: A3IDEMUX.5 16.84,6.67 v17.78,7.62 | v20.32,45.72 18.14,45.72 17.47,45.73 16.84,45.04 AI1DEMUX.5 | v20.32,24.13 18.14,24.13 16.83,23.08 16.83,22.78 AI2DEMUX.5 16.84,21.91 16.51,21.59 16.16,21.59 14.27,18.64 8.48,18.64 BPF6INTEST.1 | v46.04,26.67 C15.2
  Bottom 0.152: v17.78,7.62 20.32,10.16 v20.32,24.13 20.32,24.25 | 20.32,24.25 v20.32,45.72 | 20.32,24.25 30.06,24.25 32.84,27.66 41.31,27.66 42.17,26.67 v46.04,26.67
BPF6OUT  (via drill 0.35)
  Top 0.152: AO3MUX.5 88.32,14.89 88.02,15.16 85.09,18.09 | 85.09,18.09 v85.09,27.94 83.82,29.21 v83.82,32.36 | AO1MUX.5 84.77,41.59 v83.82,40.64 83.82,54.79 80.01,58.6 80.01,63.39 80.83,64.21 82.12,64.21 82.26,64.34 82.26,65.75 v83.82,67.31 | AMP2.6 AMP2.7 53.99,14.92 R13.1 63.21,15.9 85.34,15.9 85.7,16.26 85.7,16.76 85.09,17.37 85.09,18.09 | v90.56,26.34 89.29,27.61 AO2MUX.5
  Bottom 0.152: v85.09,27.94 85.42,27.61 89.29,27.61 v90.56,26.34 | v83.82,32.36 v83.82,40.64 | v83.82,67.31 91.44,67.31 BPF6OUTTEST.1
BW0  (via drill 0.35)
  Top 0.152: POTB.8 49.94,63.05 v49.77,61.88 | v45.28,61.95 POTB.1 43.47,65.09 C5.1
  Bottom 0.152: v49.77,61.88 49.28,62.23 46.74,62.23 46.17,61.91 v45.28,61.95
BW1  (via drill 0.35)
  Top 0.152: POTB.6 48.56,63.06 48.59,62.41 46.99,61.04 v46.99,60.96 | AMP0.5 45.07,59.08 45.07,59.4 44.45,59.74 v44.45,59.82 44.15,59.52 43.52,59.52 41.91,57.91 C6.1 37.78,60.96 v36.83,60.96 | v38.1,63.5 36.83,64.77 LPF5PREAMPTEST.1
  Bottom 0.152: v46.99,60.96 46.58,60.96 45.97,60.35 45.47,60.35 44.73,60.11 v44.45,59.82 | v36.83,60.96 38.1,62.23 v38.1,63.5
CA0  (via drill 0.35)
  Top 0.152: v58.42,68.58 59.34,67.67 POTC.3 59.34,66.82 59.34,66.23 58.74,65.85 C9.2 | v54.74,69.92 53.59,69.92 C8.1
  Bottom 0.152: v54.74,69.92 55.56,69.85 56.54,69.85 56.54,69.6 57.56,68.58 v58.42,68.58
CA1  (via drill 0.35)
  Top 0.152: C9.1 61.94,66.06 62.21,66.06 62.59,66.44 POTC.8 62.59,68.05 v62.34,68.29 | v66.04,67.31 C10.2
  Bottom 0.152: v62.34,68.29 65.06,68.29 v66.04,67.31
CA2
  Top 0.152: C10.1 64.17,72.67 POTC.11 63.88,73.26 63.51,73.64 63.2,73.64 C11.2
CA3
  Top 0.152: POTC.17 59.98,74.91 C11.1 57.47,74.93 C12.2
DRAINA  (via drill 0.35)
  Top 0.152: AMP1.2 63.53,43.88 63.93,44.28 64.43,44.28 64.58,44.13 65.96,44.13 R6.2 66.04,49.74 | 66.04,49.74 R5.2 | BPF2GS2TEST.1 72.39,73.66 v72.39,59.69 | 66.04,49.74 66.04,50.03 67.02,51.01 67.02,58.13 v67.31,58.42
  Bottom 0.152: v72.39,59.69 71.12,58.42 v67.31,58.42
DW2  (via drill 0.35)
  Top 0.152: POTE.3 v46.59,33.38 48.62,33.38 49.53,34.29 49.53,39.98 v50.8,41.25 | POTD.13 42.83,34.65 v43.18,34.29 C14.1 39.37,36.51 v39.37,49.53 | v26.67,52.07 26.67,62.23 29.21,64.77 BPF2GS1TEST.1 | AMP1.3 62.61,43.29 62.61,42.97 62.23,42.59 v62.23,41.91
  Bottom 0.152: v46.59,33.38 44.09,33.38 v43.18,34.29 | v39.37,49.53 38.1,50.8 27.94,50.8 v26.67,52.07 | v62.23,41.91 61.27,40.95 52.07,40.95 51.77,41.25 v50.8,41.25
EA1  (via drill 0.35)
  Top 0.152: POTE.8 48.99,30.12 v49.25,29.87 49.25,27.98 C15.1 | v52.09,28.77 53.56,28.77 POTE.11
  Bottom 0.152: v49.25,29.87 50.35,28.77 v52.09,28.77
EW2  (via drill 0.35)
  Top 0.152: v60.96,39.37 61.58,38.75 AMP1.10 | POTE.13 53.38,30.37 52.79,30.37 52.65,30.5 52.65,31.05 52.68,31.07 52.07,31.67 50.8,32.94 50.8,35.15 | 51.02,37.05 50.8,36.83 | 50.8,35.15 50.8,36.83 | POTE.17 53.38,32.97 52.79,32.97 52.65,33.1 52.65,33.29 50.8,35.15 | 50.8,36.83 51.12,37.15 C16.1 52.1,37.18 v53.72,37.18
  Bottom 0.152: v53.72,37.18 55.28,39.37 v60.96,39.37
FA3  (via drill 0.35)
  Top 0.152: POTG.3 36.16,19.57 36.16,20.16 37.27,21.27 C19.1 40.64,22.86 v41.91,24.13 | POTF.17 79.7,31.45 v81.28,29.87
  Bottom 0.152: v41.91,24.13 73.66,24.13 74.93,25.4 78.74,25.4 81.28,27.94 v81.28,29.87
FW1  (via drill 0.35)
  Top 0.152: AMP1.12 v62.88,38.98 | v73.38,29.87 73.1,30.16 POTF.6 68.91,30.16 68.58,30.48 v68.58,34.29 68.58,49.1 67.97,49.71 67.97,60.71 66.7,61.98 66.7,62.48 67.31,63.09 BPF6GS2TEST.1 | v76.2,29.21 76.2,27.94 76.58,27.55 POTF.11 | C18.1 63.63,34.73 v63.63,36.13
  Bottom 0.152: v73.38,29.87 75.54,29.87 v76.2,29.21 | v68.58,34.29 67.63,35.24 v63.63,36.13 62.88,36.88 v62.88,38.98
GND  (via drill 0.35)
  Top 0.152: C23.2 R25.2 | POTB.16 POTB.15 | POTD.15 POTD.16 | POTE.16 POTE.15 | AO1MUX.8 87.97,39.63 v86.97,40.64 | v86.97,38.1 86.36,38.1 | 35.56,21.59 35.55,21.57 35.55,20.42 35.27,20.14 POTG.4 35.24,19.07 35.24,18.48 36.83,17.18 36.83,16.89 | POTC.6 | POTC.6 v61.28,68.3 | POTC.13 | POTC.13 62.59,73.68 | 57.15,73.66 58.42,73.66 58.69,73.39 POTC.19
  Bottom 0.152: v86.97,40.64 v86.97,38.1 | v61.28,68.3 62.14,68.9 v64.52,68.9
  other vias: 39.37,52.07 51.82,33.02 68.58,26.67 72.39,25.4 80.01,29.21 72.39,34.29 82.55,34.29 82.55,22.86 88.9,21.59 87.63,20.32 32.64,54.61 46.99,27.94 59.31,32.77 31.24,23.5 37.08,23.5 57.15,66.04 57.15,69.85 64.77,66.04 61.72,62.99 76.2,33.02 34.92,15.24 38.73,17.65
  pour Top: 0,80.01 142.24,80.01 142.24,0 0,0
  pour Bottom: 0,80.01 142.24,80.01 142.24,0 0,0
GW0  (via drill 0.35)
  Top 0.152: AMP2.3 53.48,12.03 53.16,12.03 52.39,13.06 v52.07,13.06 | 49.53,20.32 v50.8,19.05 | 49.53,20.32 38.1,20.32 37.22,19.43 POTG.1 | v34.29,21.59 33.02,21.59 32.66,21.23 POTG.8 32.66,19.07 32.66,18.48 32.29,18.36 31.74,18.36 31.69,18.42 31.64,18.36 31.09,18.36 30.35,19.1 v30.35,57.02 | v48.26,21.59 48.58,21.59 C20.1 49.53,20.32 | v29.21,62.23 31.45,64.47 31.45,69.98 31.75,70.28 BPF6GS3TEST.1
  Bottom 0.152: v52.07,13.06 50.8,14.33 v50.8,19.05 | v34.29,21.59 v48.26,21.59 | v30.35,57.02 29.21,58.17 v29.21,62.23
HPF1IN  (via drill 0.35)
  Top 0.152: A3IDEMUX.15 14.88,11.52 14.89,11.26 14.51,11.09 13.96,11.09 13.62,11.43 v12.7,11.43 | AI2DEMUX.15 14.9,27.98 14.84,27.6 14.58,27.6 13.96,27.6 13.71,27.85 v12.7,27.85 | HPF1INTEST.1 11.43,48.26 v12.7,48.26 14.26,48.26 14.88,48.88 AI1DEMUX.15 | C7.2 24.13,57.15 v22.86,52.07
  Bottom 0.152: v12.7,48.26 v12.7,27.85 v12.7,11.43 | v22.86,52.07 12.7,52.07 HPF1INTEST.1
HPF1OUT  (via drill 0.35)
  Top 0.152: AO3MUX.15 95.14,16.86 96.52,18.25 v96.52,19.05 | v96.52,31.75 96.52,30.25 95.84,29.57 AO2MUX.15 | AMP0.8 AMP0.9 44.42,53.17 44.42,53.75 45.47,54.59 50.04,54.59 52.49,52.14 54.6,52.14 v55.88,50.87 55.88,51.12 R3.2 | v88.9,48.26 89.29,48.26 93.81,43.58 94.11,43.58 AO1MUX.15 95.61,43.53 v96.52,44.45 96.52,44.86 97.13,45.47 97.13,60.3 HPF1OUTTEST.1
  Bottom 0.152: v96.52,19.05 v96.52,31.75 96.52,42.68 96.27,42.93 96.27,43.43 96.52,43.68 v96.52,44.45 | v88.9,48.26 88.05,49.11 86.01,49.11 85.56,48.67 66.9,48.67 63.5,52.07 59.69,52.07 | v55.88,50.87 57.08,52.07 59.69,52.07 | 59.69,52.07
HPF5IN  (via drill 0.35)
  Top 0.152: AI2DEMUX.12 16.84,28.64 16.61,28.83 13.97,31.44 v13.97,31.75 | v35.56,72.39 30.48,77.47 24.13,77.47 22.76,76.1 22.76,65.56 20.32,63.12 HPF5INTEST.1 20.32,53.34 17.78,50.8 17.47,50.8 16.84,50.43 16.84,50.17 AI1DEMUX.12 v16.84,47.87 | v16.84,9.77 A3IDEMUX.12 | C8.2 v51.44,72.07
  Bottom 0.152: v51.44,72.07 50.99,72.39 v35.56,72.39 | v16.84,47.87 16.12,47.87 13.97,45.72 v13.97,31.75 13.97,31.34 14.58,30.73 14.58,30.23 13.97,29.62 13.97,11.43 14.36,11.04 15.56,11.04 v16.84,9.77
HPF5OUT  (via drill 0.35)
  Top 0.152: AMP0.13 v48.58,52.96 AMP0.14 | AO1MUX.12 94.58,41.63 94.87,41.63 94.94,41.91 v97.79,41.91 97.79,42.32 98.4,42.93 98.4,43.43 99.06,44.04 v99.06,50.8 v99.06,59.69 | AO3MUX.12 94.83,14.91 98.8,18.88 v98.8,19.31 | AO2MUX.12 94.37,27.61 97.11,27.61 98.4,28.96 98.4,29.67 v98.8,30.07 | 53.02,50.8 R4.1 v53.34,49.66
  Bottom 0.152: v48.58,52.96 49.22,50.8 49.22,49.84 49.53,49.53 53.21,49.53 v53.34,49.66 53.56,49.66 56.9,53 63,53 65.2,50.8 v99.06,50.8 | v97.79,41.91 98.8,40.9 v98.8,30.07 v98.8,19.31 | v99.06,59.69 100.33,59.69 HPF5OUTTEST.1
I2C1SCL  (via drill 0.35)
  Top 0.152: R28.1 U$4.17 | U$2.4 113.59,75.5 114.58,76.48 125.52,76.48 v130,72
  Bottom 0.152: 127.13,23.16 126.87,23.16 | 126.87,23.16 127.13,23.16 | U$4.17 133.06,10.45 133.06,17.23 127.13,23.16 | v130,72 130,58.86 131.42,57.44 131.42,56.9 130.52,56 130.52,26.56 127.13,23.16 | 126.87,23.16 121.56,23.16 121.56,25.45 121.92,25.45 121.92,23.16 126.87,23.16
I2C1SDA  (via drill 0.35)
  Top 0.152: U$4.19 137.48,8.57 R29.1 | U$2.1 103.38,63.38 104.04,62.71 104.04,61.75 104,61.71 v104,48 | v126.34,12.58 126.03,12.89 126.03,40.4 122,44.43 v122,46
  Bottom 0.152: v104,48 114.97,48 119.13,43.84 119.63,43.84 121.79,46 v122,46 | v126.34,12.58 126.51,12.41 129.95,12.41 130.52,11.84 130.52,9.73 131.1,9.15 131.1,8.48 131.67,7.91 135.03,7.91 136.01,8.89 U$4.19
I2C2SCL  (via drill 0.35)
  Top 0.152: 124.46,8.83 U$4.9 | 124.46,8.83 R26.1 | SCLMUX.3 83.04,58.71 83.33,58.71 84.43,57.47 v84.43,57.15 | 124.46,8.83 125.67,8.83 126.59,7.91 127.41,7.91 127.98,8.48 127.98,11.84 126.39,13.43 126.39,30.29 128.29,32.18 128.29,52.93 128.99,53.63 129.95,53.63 130.52,54.2 130.52,56.86 v130.81,57.15
  Bottom 0.152: v84.43,57.15 108.36,57.15 108.97,56.54 109.47,56.54 110.08,57.15 v130.81,57.15
I2C2SDA  (via drill 0.35)
  Top 0.152: POTA.9 32.03,62.76 32.03,63.35 31.75,63.86 31.75,69.85 v33.02,71.12 | v93.98,72.39 96.52,69.85 v96.52,48.26 | v120.65,43.18 125.73,38.1 125.73,10.16 U$4.11 | POTE.9 46.97,29.48 v45.58,29.36 45.16,27.67 45.16,25.82 45.72,25.27 v45.72,24.74 | v33.02,29.21 32.02,28.2 POTG.9 | v49.53,57.15 50.53,58.16 POTB.9 50.53,64.5 v50.8,64.77 | v41.91,52.07 41.91,43.04 41.93,43.02 41.93,42.43 POTD.9 41.93,41.95 41.93,41.36 41.91,41.34 v41.91,40.92 | v62.23,64.77 63.23,65.78 POTC.9 63.21,67.05 v63.21,71.22 | v35.55,36.83 35.52,36.8 v35.52,29.36 | POTF.9 72.35,27.96 72.94,27.96 73.08,27.83 73.08,27.28 72.94,27.15 72.87,27.15 v72.39,26.67 | v129.54,7.3 R27.1
  Bottom 0.152: v93.98,72.39 72.77,72.39 71.6,71.22 v63.21,71.22 33.12,71.22 v33.02,71.12 | v96.52,48.26 101.6,43.18 v120.65,43.18 | v45.58,29.36 v35.52,29.36 33.16,29.36 v33.02,29.21 | v49.53,57.15 46.99,57.15 v41.91,52.07 | U$4.11 127.96,8.89 128.94,9.87 129.95,9.87 130.52,9.3 130.52,8.48 129.54,7.5 v129.54,7.3 | v62.23,64.77 60.96,63.5 59.69,63.5 58.42,62.23 51.82,62.23 51.82,63.75 v50.8,64.77 | v35.55,36.83 35.65,36.83 36.58,37.76 38.74,37.76 v41.91,40.92 | v45.72,24.74 46.38,25.4 71.12,25.4 v72.39,26.67
LPF1IN  (via drill 0.35)
  Top 0.152: LPF1INTEST.1 16.18,60.63 AI1DEMUX.13 16.18,49.2 15.7,48.72 v15.7,48.3 | POTA.3 35.91,64.42 v34.29,66.04 | A3IDEMUX.13 16.18,11.54 16.18,11.13 15.5,10.78 12.49,10.78 11.84,11.43 v10.82,11.43 | AI2DEMUX.13 16.18,27.88 16.11,27.61 14.88,26.67 v10.82,26.67
  Bottom 0.152: LPF1INTEST.1 v34.29,66.04 | v10.82,11.43 v10.82,26.67 10.82,47.24 12.45,48.87 12.95,48.87 13.56,48.26 15.7,48.26 v15.7,48.3
LPF1OUT  (via drill 0.35)
  Top 0.152: AMP0.2 AMP0.1 48.26,59.39 v48.26,59.69 | 68.61,60.99 v68.58,60.96 | 68.61,60.99 71.12,63.5 LPF1OUTTEST.1 R1.1 | v72.39,45.72 68.61,49.5 68.61,60.99 | AO3MUX.13 94.7,15.56 97.79,18.66 v97.79,19.05 | v97.79,29.21 96.84,28.27 AO2MUX.13 | v97.79,43.18 96.84,42.23 AO1MUX.13
  Bottom 0.152: v48.26,59.69 49.53,60.96 v68.58,60.96 | v97.79,19.05 v97.79,29.21 97.79,41.05 97.18,41.66 97.18,42.16 97.79,42.77 v97.79,43.18 97.13,43.84 97.13,45.97 96.77,46.33 86.11,46.33 84.78,45 84.78,43.18 78.79,43.18 78.48,43.48 74.62,43.48 v72.39,45.72
LPF5IN  (via drill 0.35)
  Top 0.152: 32.83,62.67 POTA.8 32.66,64.79 v32.83,64.96 | v17.78,63.5 15.54,61.26 AI1DEMUX.14 15.54,49 15.09,48.55 15.09,48.11 v13.97,46.99 | AI2DEMUX.14 15.54,28.91 v13.97,30.48 | A3IDEMUX.14 15.53,11.93 15.53,12.23 13.63,13.97 v13.31,13.97
  Bottom 0.152: v13.97,46.99 13.01,46.02 13.01,30.38 | 13.01,30.38 13.01,28.41 13.31,28.1 13.31,27.6 13.01,27.3 13.01,16.82 13.31,16.51 v13.31,13.97 | v13.97,30.48 13.1,30.48 13.01,30.38 | LPF5INTEST.1 v17.78,63.5 31.37,63.5 v32.83,64.96
LPF5OUT  (via drill 0.35)
  Top 0.152: AMP0.7 AMP0.6 44.42,57.18 44.45,57.15 43.18,55.88 43.18,46.99 v44.45,45.72 | v96.88,43.18 96.59,42.88 AO1MUX.14 94.13,42.91 93.83,42.91 93.62,43.28 v92.81,43.28 | v97.18,30.48 95.62,28.91 AO2MUX.14 | AO3MUX.14 94.92,16.21 97.18,18.48 v97.18,20.32 | v90.17,40.64 89.24,39.71 89.24,39.37 89.11,39.23 84.37,39.23 83.28,40.32 R2.1 v80.01,45.72 80.01,50.8 v81.28,52.07 | v111.76,55.88 114.3,58.42 LPF5OUTTEST.1
  Bottom 0.152: v96.88,43.18 96.88,42.29 96.88,41.53 97.48,40.93 97.48,30.78 v97.18,30.48 v97.18,20.32 | v44.45,45.72 45.11,46.38 78.72,46.38 | 78.72,46.38 78.74,46.38 | v92.81,43.28 v90.17,40.64 | v80.01,45.72 79.38,45.72 78.72,46.38 | v81.28,52.07 109.22,52.07 109.22,53.34 v111.76,55.88
N$1
  Top 0.152: D1.A 91.43,74.88 CL_RES.1
N$15  (via drill 0.35)
  other vias: 55.88,68.58
N$136  (via drill 0.35)
  Top 0.152: R10.1 60.96,37.72 AMP1.9 60.93,38.54 60.42,39.05 R8.2 58.42,58.42 58.42,60.96 v59.69,62.23 | v67.31,62.23 69.85,64.77 69.85,76.2 68.58,77.47 BPF6GS1TEST.1
  Bottom 0.152: v59.69,62.23 v67.31,62.23
N$140
  Top 0.152: AMP1.13 63.26,37.45 63.26,36.72 61.94,35.4 61.94,34.49 61.73,34.29 59.69,34.29 58.42,33.02 58.42,29.21 59.69,27.94 R11.1 R9.1
N$142
  Top 0.152: AMP2.5 53.88,13.36 56.16,13.36 57.92,11.43 R12.1 57.12,10.45 55.45,10.45 55.16,10.75 AMP2.1
N$143
  Top 0.152: R12.2 56.17,11.4 AMP2.2 53.39,11.41 53.07,11.41 51.94,9.95 R30.2
NCPOT
  Top 0.152: SCLMUX.4 90.8,59.37 R15.2
NODEA  (via drill 0.35)
  Top 0.152: AMP0.10 45.08,53.56 45.34,53.71 45.72,53.93 v45.72,53.99 | v50.8,55.88 53.34,58.42 v53.34,66.04 53.34,67.31 51.79,68.86 POTB.11 | POTB.17 | POTB.17 v47.28,67.46 | C7.1 26.67,64.45 HPF1PREAMPTEST.1 | v46.99,73.66 47.28,73.36 POTB.17
  Bottom 0.152: v45.72,53.99 47.61,55.88 v50.8,55.88 | v47.28,67.46 49.09,66.04 v53.34,66.04 | HPF1PREAMPTEST.1 v46.99,73.66
NODEB  (via drill 0.35)
  Top 0.152: AMP0.12 v46.37,51.71 46.08,51.28 POTD.3 v46.08,40.92 | v42.83,40.79 42.83,41.17 POTD.8 42.83,46.38 v42.52,46.38 | HPF5PREAMPTEST.1 v13.97,58.42 | v25.4,57.15 25.4,48.92 v27.94,46.38 | C12.1 55.88,69.44 55.27,68.83 55.27,68.33 55.88,67.72 v55.88,57.15
  Bottom 0.152: v55.88,57.15 53.34,54.61 48.26,54.61 47.22,53.57 46.8,53.57 46.37,53.14 v46.37,51.71 | v25.4,57.15 24.13,58.42 v13.97,58.42 | v27.94,46.38 v42.52,46.38 | v42.83,40.79 42.98,40.64 45.92,40.64 v46.08,40.92
NODEC  (via drill 0.35)
  Top 0.152: POTD.11 v41.47,37.95 41.47,38.93 v41.91,39.37 | POTD.17 45.42,38.4 v44.44,39.38 | v36.83,35.5 C13.1
  Bottom 0.152: v36.83,35.5 38.57,36.55 40.07,36.55 v41.47,37.95 | v44.44,39.38 41.92,39.38 v41.91,39.37
NODED
  Top 0.152: POTF.3 72.35,32.35 72.94,32.35 74.93,34.34 74.93,34.49 | 74.93,34.49 C17.1 | POTF.8 74.58,28.86 74.93,29.21 74.93,34.49
NODEE  (via drill 0.35)
  Top 0.152: 35.34,10.16 R24.2 | 35.34,10.16 37.78,10.16 C22.1 38.1,11.43 v38.86,12.19 | 35.34,10.16 33.95,11.55 33.59,11.2 33.09,11.2 32.39,11.89 32.39,12.07 31.74,12.72 31.69,12.78 31.64,12.72 30.87,12.72 27.08,16.51 v22.86,16.51 10.16,16.51 7.75,14.1 60HZPREAMPTEST.1 | v45.59,12.82 46.33,13.35 AMP2.10
  Bottom 0.152: v38.86,12.19 43.42,12.82 v45.59,12.82
NODEF
  Top 0.152: R24.1 32.07,10.16 R23.2 31.66,8.57 32.36,7.87 32.36,7.33 C23.1
NODEG
  Top 0.152: C21.1 R25.1 34.61,5.26 34.36,5.5 34.36,7.2 35.11,7.94 C22.2
PASSTHRUIN  (via drill 0.35)
  Top 0.152: v12.7,7.62 14.88,7.62 16.18,6.68 16.19,6.52 A3IDEMUX.4 16.19,6.5 16.18,6.75 16.26,6.83 v16.51,7.62 | AI2DEMUX.4 16.22,22.75 16.22,23.05 13.61,25.4 v12.09,25.4 | PASSTHRUTEST.1 10.16,68.58 4.76,62.1 4.76,51.94 10.16,45.72 v12.09,45.72 14.88,45.72 15.16,46 16,46 16.18,45.81 AI1DEMUX.4 | v20.32,7.62 v31.75,7.62 | v44.45,8.89 47.16,11.38 47.16,11.65 47.25,12.03 47.54,12.03 AMP2.12
  Bottom 0.152: v12.7,7.62 12.09,8.23 v12.09,25.4 v12.09,45.72 | v16.51,7.62 16.92,7.62 17.53,7.01 18.03,7.01 18.64,7.62 v20.32,7.62 | v31.75,7.62 33.02,8.89 v44.45,8.89
PASSTHRUOUT  (via drill 0.35)
  Top 0.152: AO3MUX.4 88.38,15.55 88.02,15.81 87.89,15.95 87.89,16.21 v87.58,16.51 | v87.58,26.67 87.89,26.97 87.89,27.89 88.27,28.27 AO2MUX.4 88.77,28.25 89.06,28.25 89.24,28.64 89.24,30.48 87.63,32.1 v87.63,32.36 | AMP2.13 AMP2.14 50.8,7.62 80.01,7.62 81.28,8.89 v82.55,8.89 | v87.46,42.93 87.89,42.88 87.89,42.62 88.27,42.23 AO1MUX.4
  Bottom 0.152: v87.58,26.67 88.29,25.96 88.29,21.34 88.9,20.73 88.9,19.05 87.58,17.73 v87.58,16.51 87.58,13.92 v82.55,8.89 | v87.63,32.36 87.63,40.08 87.58,40.63 v87.46,42.93
S1INPUT
  Top 0.152: AI1DEMUX.3 15.54,44.73 15.21,45.06 14.89,45.06 7.62,45.06 7.01,44.44 SENSOR1INPUT.1
  Bottom 0.152: S1INPUT.3 2.54,54.26 1.82,53.17 1.82,47.46 SENSOR1INPUT.1
S2INPUT
  Top 0.152: AI2DEMUX.3 15.53,22.77 15.53,23.06 15.15,23.2 7.28,23.2 4.45,25.65 3.81,26.29 3.81,36.83 5.46,38.48 | 5.46,38.48 SENSOR2INPUT.1 | S2INPUT.3 3.09,41.31 5.46,38.48
S3INPUT  (via drill 0.35)
  Top 0.152: A3IDEMUX.3 15.52,5.6 15.35,5.33 12.36,2.54 v9.78,2.54
  Bottom 0.152: 8.11,30.93 8.13,30.86 | 8.11,30.93 SENSOR3INPUT.1 | v9.78,2.54 9.78,11.81 8.89,12.7 8.89,13.11 8.28,13.72 8.28,22.52 | 8.11,30.93 8.28,30.76 8.28,22.52 | S3INPUT.3 7.89,22.13 8.28,22.52
SCLA  (via drill 0.35)
  Top 0.152: SCLMUX.13 77.32,59.38 77.62,59.38 77.81,59.74 77.81,62.23 77.47,62.58 77.47,64.77 R22.2 76.5,66.04 v75.11,64.9 | POTA.14 33.33,57.2 33.33,57.78 33.69,57.84 33.71,57.84 v34.29,58.42
  Bottom 0.152: v34.29,58.42 34.95,59.08 48.51,59.08 49.12,59.69 71.12,59.69 75.11,63.8 v75.11,64.9
SCLB  (via drill 0.35)
  Top 0.152: POTB.14 49.23,68.66 49.23,68.07 48.86,67.89 48.84,67.89 v48.47,67.52 | v79.88,67.32 79.93,67.02 80.44,65.75 81.09,65.09 R21.2 79.3,63.11 79.3,62.66 79.17,62.52 79.03,62.52 78.74,62.23 78.12,60.87 78.12,58.93 77.91,58.72 SCLMUX.14
  Bottom 0.152: 48.68,67.31 v48.47,67.52 49.96,66.34 52.79,66.34 53.09,66.65 55.69,66.65 56.9,65.43 74.22,65.43 74.85,66.06 75.61,66.06 75.63,66.04 78.74,66.04 78.74,66.18 v79.88,67.32
SCLC  (via drill 0.35)
  Top 0.152: SCLMUX.15 76.76,58.06 76.46,58.31 74.24,58.75 74.24,65.74 76.2,67.44 v76.2,69.85 76.52,70.17 R20.2 | POTC.14 61.92,72.46 61.92,71.88 62.23,71.79 v62.23,70.61
  Bottom 0.152: v62.23,70.61 62.99,69.85 v76.2,69.85
SCLD  (via drill 0.35)
  Top 0.152: SCLMUX.12 75.88,60.02 74.8,60.33 v74.87,62.48 75.89,63.5 R19.2 | POTD.14 | POTD.14 v43.48,37.82 | v73.28,63.63 73.28,57.03 73.59,56.73 73.59,41.98 v73.66,41.91
  Bottom 0.152: v73.66,41.91 72.39,40.64 47.09,40.64 46.04,39.59 46.01,38.95 v43.48,37.82 | v74.87,62.48 76.22,64.18 76.22,65.02 75.48,65.76 74.98,65.76 74.37,65.15 74.37,64.47 v73.28,63.63
SCLE  (via drill 0.35)
  Top 0.152: R18.2 82.16,63.82 80.98,62.64 80.85,62.64 80.31,62.1 80.31,58.73 | 80.31,58.73 | 80.31,58.73 81.62,57.41 SCLMUX.1 82.81,57.41 v83.19,56.52 | POTE.14 53.86,31.02 54.45,31.02 54.59,31.15 54.59,31.7 54.56,31.72 55.88,33.04 55.88,49.53 v57.15,50.8 | v63.5,50.8 64.77,52.07 v64.77,55.88
  Bottom 0.152: v57.15,50.8 v63.5,50.8 | v64.77,55.88 66.04,57.15 82.55,57.15 v83.19,56.52
SCLF  (via drill 0.35)
  Top 0.152: POTF.14 77.51,29.75 76.92,29.75 76.78,29.88 76.78,30.43 76.81,30.45 76.2,31.05 75.63,31.05 75.23,31.45 75.23,33.98 76.2,34.95 76.2,54.61 | 76.2,54.61 78.79,57.2 v78.79,59.74 | v81.4,60.02 SCLMUX.5 | 76.2,54.61 74.93,55.88 R17.2
  Bottom 0.152: v78.79,59.74 79.06,60.02 v81.4,60.02
SCLG  (via drill 0.35)
  Top 0.152: v33.22,15.44 33.22,15.01 33.27,14.96 33.27,13.73 POTG.14 | 33.34,28.2 v33.34,28.32 | 33.34,28.2 34.29,28.89 34.29,43.18 v35.56,44.45 | v85.09,46.38 84.12,47.35 84.12,54.91 83.82,55.22 83.82,57.15 83.56,57.41 83.56,57.69 83.43,57.82 83.28,58.06 SCLMUX.2 | 33.34,28.2 33.34,26.92 R16.2 33.27,26.6 v33.27,24.64
  Bottom 0.152: v33.22,15.44 33.34,15.56 33.27,15.63 v33.27,24.64 | v35.56,44.45 36.89,45.78 42.77,45.78 43.68,46.69 85.09,46.69 v85.09,46.38
SCLS0  (via drill 0.35)
  Top 0.152: SCLMUX.11 77.14,60.62 v76.07,60.62 | v120.65,50.19 114.36,50.19 108.61,55.94 108.61,58.31 v108.5,58.42
  Bottom 0.152: v76.07,60.62 78.4,58.42 v108.5,58.42 | v120.65,50.19 121.92,51.46 U$4.27
SCLS1  (via drill 0.35)
  Top 0.152: SCLMUX.10 77.06,61.24 v75.54,61.37 | v107.83,59.03 107.83,56.01 114.3,49.53 v121.92,49.53
  Bottom 0.152: v75.54,61.37 75.55,61.23 76.45,61.23 78.95,58.73 107.52,58.73 v107.83,59.03 | v121.92,49.53 U$4.29
SCLS2  (via drill 0.35)
  Top 0.152: SCLMUX.9 77.02,61.85 v76.09,62.1 | v109.22,57.15 113.32,53.05 113.32,51.66 114.18,50.8 125.73,50.8 U$4.31
  Bottom 0.152: v109.22,57.15 108.92,57.15 107.95,58.12 77.81,58.12 | 77.81,58.12 77.81,58.16 | v76.09,62.1 75.96,61.98 75.28,61.98 74.93,61.62 74.93,60.91 75.82,60.02 76.27,60.02 77.81,58.56 77.81,58.12
SSIOCLK  (via drill 0.35)
  Top 0.152: U$4.40 136.01,54.61 135.03,53.63 131.67,53.63 131.1,54.2 131.1,55.02 131.42,55.34 131.42,57.4 131.06,57.76 130.24,57.76 v130,58 | v116,60 116,74.45 U$1.1
  Bottom 0.152: v130,58 118,58 v116,60
SSIOFSS
  Top 0.152: U$4.38 134.62,63.83 U$1.5
SSIORX
  Top 0.152: U$4.36 132.08,62.37 U$1.3
SSIOTX  (via drill 0.35)
  Top 0.152: U$1.2 118,74.45 v118,56 | v122,22.2 123.33,23.52 123.44,23.52 123.8,23.88 123.8,24.38 120.04,28.14 120.04,45.96 v118,48
  Bottom 0.152: v118,56 v118,48 | U$4.15 132.08,10.04 131.1,11.02 131.1,13.1 v122,22.2
STAGE1OUT  (via drill 0.35)
  Top 0.152: v74.93,39.3 C17.2 | v58.42,35.5 R8.1 58.99,37.72 AMP1.8
  Bottom 0.152: v74.93,39.3 74.49,39.69 74.04,39.75 62.2,39.75 61.21,38.76 60.03,38.76 R8.1 v58.42,35.5
STAGE2OUT  (via drill 0.35)
  Top 0.152: C19.2 40.98,19.71 v43.18,19.71 | v62.23,21.59 62.23,25.9 63.43,27.09 63.43,29.46 R9.2 64.45,31.93 64.48,31.96 64.48,37.42 AMP1.14
  Bottom 0.152: v43.18,19.71 43.79,20.32 60.96,20.32 v62.23,21.59

### Text on the board
tNames: sdmay18-31 / PCB Rev II